# Altium project higgs.PrjPCB (part 2 of 7)

## Sheet fpga-bank4.SchDoc: CS - FPGA - Bank 4
size Letter; CheckedBy: J. Brinton; CompanyName: Signal Laboratories, Inc.; DrawnBy: J. Brinton; Engineer: J. Brinton; Address1: 3479 Edison Way; Address2: Menlo Park CA 94025; Address3: +1 (877) 778-8435; Address4: siglabs.com; Revision: 3; SheetNumber: 9; SheetTotal: 47
Used 8 times, as channels MAIN/ARRAY/FPGA30/FPGA4B, MAIN/ARRAY/FPGA31/FPGA4B, MAIN/ARRAY/FPGA32/FPGA4B, MAIN/ARRAY/FPGA33/FPGA4B, MAIN/ARRAY/FPGA20/FPGA4B, MAIN/ARRAY/FPGA21/FPGA4B, MAIN/ARRAY/FPGA22/FPGA4B, MAIN/ARRAY/FPGA23/FPGA4B. Parts and nets are listed once, with the designators drawn on the sheet.
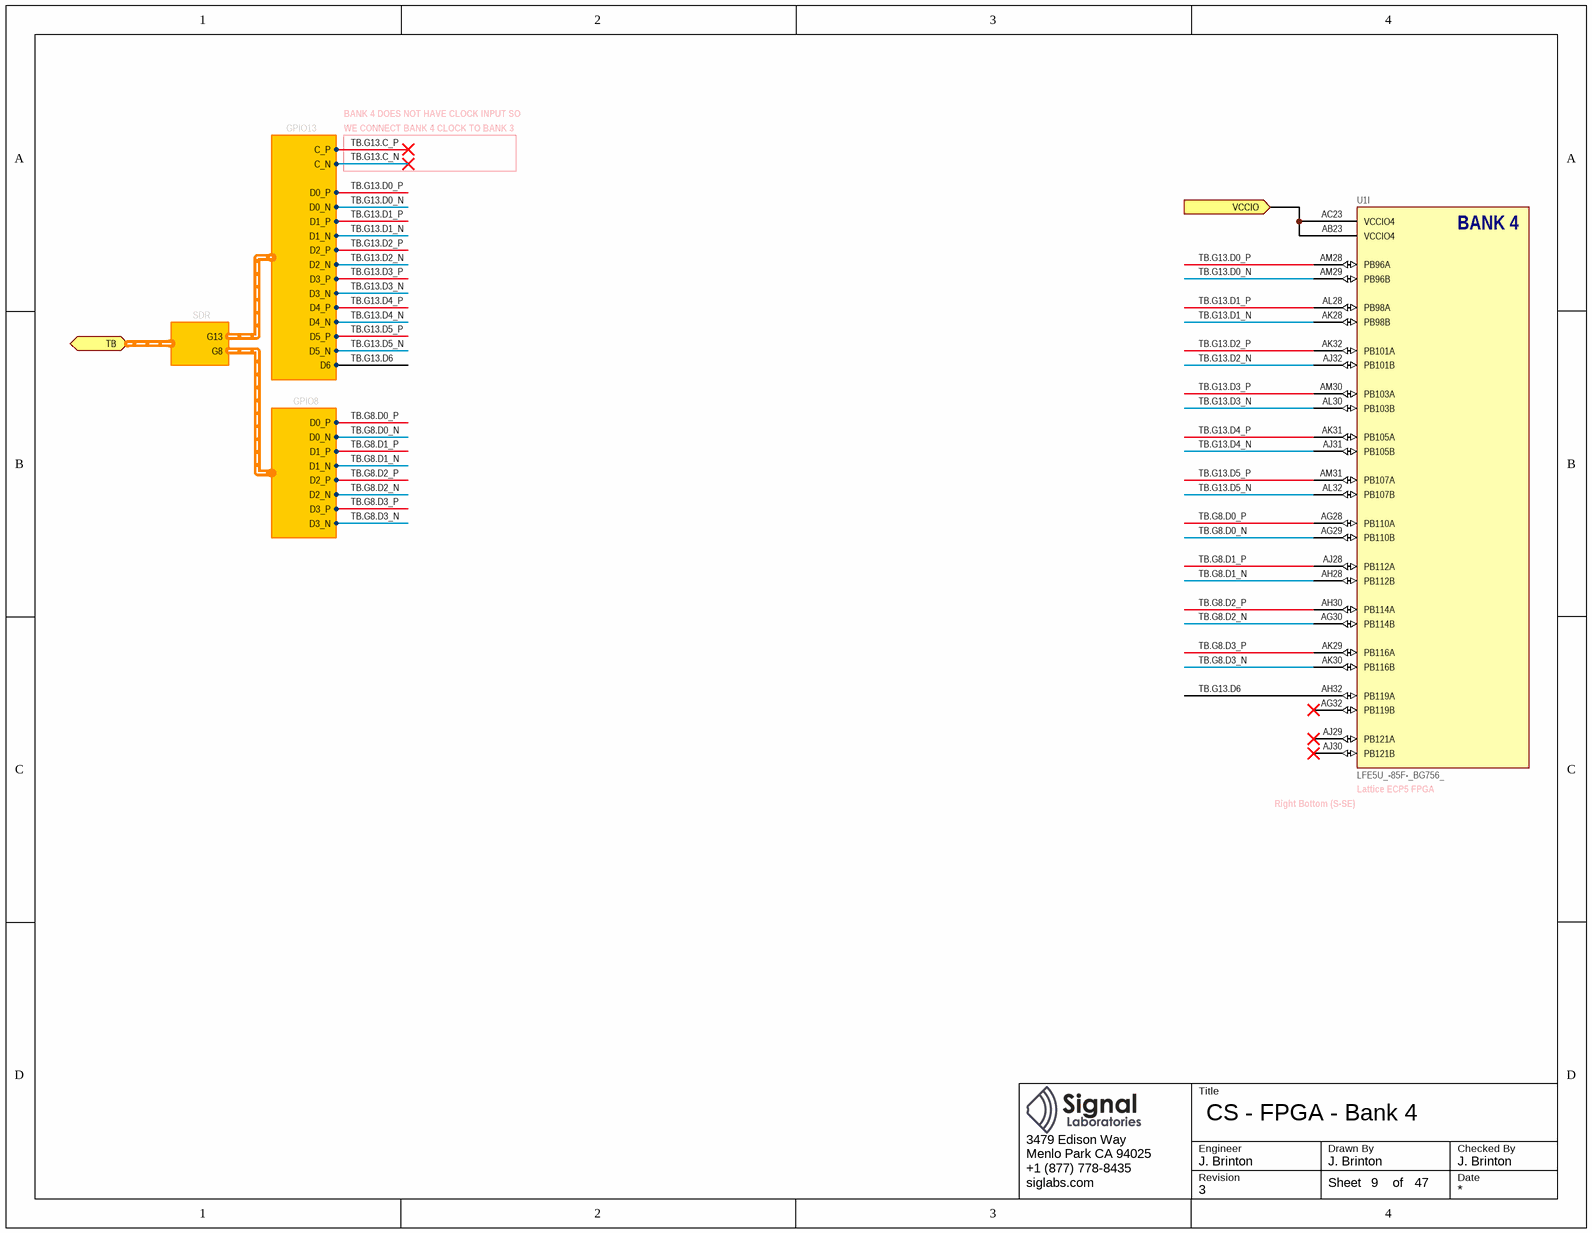
[diagram p8: fpga-bank4.SchDoc]

### Parts
U1  LFE5U_-85F-_BG756_  [caBGA756]  (part I of 19)

### Ports
TB (harness SDR), VCCIO (in)

### Harnesses
SDR: G13, G8
GPIO13: C_P, C_N, D0_P, D0_N, D1_P, D1_N, D2_P, D2_N, D3_P, D3_N, D4_P, D4_N, D5_P, D5_N, D6
GPIO8: D0_P, D0_N, D1_P, D1_N, D2_P, D2_N, D3_P, D3_N

### Nets
TB.G8.D0_N: U1.AG29(PB110B) ; harness GPIO8.D0_N
TB.G8.D0_P: U1.AG28(PB110A) ; harness GPIO8.D0_P
TB.G8.D1_N: U1.AH28(PB112B) ; harness GPIO8.D1_N
TB.G8.D1_P: U1.AJ28(PB112A) ; harness GPIO8.D1_P
TB.G8.D2_N: U1.AG30(PB114B) ; harness GPIO8.D2_N
TB.G8.D2_P: U1.AH30(PB114A) ; harness GPIO8.D2_P
TB.G8.D3_N: U1.AK30(PB116B) ; harness GPIO8.D3_N
TB.G8.D3_P: U1.AK29(PB116A) ; harness GPIO8.D3_P
TB.G13.C_N: harness GPIO13.C_N
TB.G13.C_P: harness GPIO13.C_P
TB.G13.D0_N: U1.AM29(PB96B) ; harness GPIO13.D0_N
TB.G13.D0_P: U1.AM28(PB96A) ; harness GPIO13.D0_P
TB.G13.D1_N: U1.AK28(PB98B) ; harness GPIO13.D1_N
TB.G13.D1_P: U1.AL28(PB98A) ; harness GPIO13.D1_P
TB.G13.D2_N: U1.AJ32(PB101B) ; harness GPIO13.D2_N
TB.G13.D2_P: U1.AK32(PB101A) ; harness GPIO13.D2_P
TB.G13.D3_N: U1.AL30(PB103B) ; harness GPIO13.D3_N
TB.G13.D3_P: U1.AM30(PB103A) ; harness GPIO13.D3_P
TB.G13.D4_N: U1.AJ31(PB105B) ; harness GPIO13.D4_N
TB.G13.D4_P: U1.AK31(PB105A) ; harness GPIO13.D4_P
TB.G13.D5_N: U1.AL32(PB107B) ; harness GPIO13.D5_N
TB.G13.D5_P: U1.AM31(PB107A) ; harness GPIO13.D5_P
TB.G13.D6: U1.AH32(PB119A) ; harness GPIO13.D6
VCCIO: U1.AB23(VCCIO4) U1.AC23(VCCIO4) ; port VCCIO

Not connected (* = marked no-connect by the designer): U1 AG32(PB119B)* AJ29(PB121A)* AJ30(PB121B)*

### Channels
MAIN/ARRAY/FPGA30/FPGA4B: designators end in A#5; ports VCCIO=IL34.VIOTB_FPGA30
MAIN/ARRAY/FPGA31/FPGA4B: designators end in B#5; ports VCCIO=IL34.VIOTB_FPGA31
MAIN/ARRAY/FPGA32/FPGA4B: designators end in C#5; ports VCCIO=IL34.VIOTB_FPGA32
MAIN/ARRAY/FPGA33/FPGA4B: designators end in D#5; ports VCCIO=IL34.VIOTB_FPGA33
MAIN/ARRAY/FPGA20/FPGA4B: designators end in E#5; ports VCCIO=A.VIOTB_FPGA20
MAIN/ARRAY/FPGA21/FPGA4B: designators end in F#5; ports VCCIO=A.VIOTB_FPGA21
MAIN/ARRAY/FPGA22/FPGA4B: designators end in G#5; ports VCCIO=A.VIOTB_FPGA22
MAIN/ARRAY/FPGA23/FPGA4B: designators end in H#5; ports VCCIO=A.VIOTB_FPGA23

### Notes on the sheet
- BANK 4 DOES NOT HAVE CLOCK INPUT SO
- WE CONNECT BANK 4 CLOCK TO BANK 3
- (near U1) Right Bottom (S-SE)
- (near U1) Lattice ECP5 FPGA
- Title
- Engineer
- Revision
- Drawn By
- Checked By
- Date
- Sheet
- of
- (in symbol LFE5U_-85F-_BG756_, part I) BANK 4

### Library data of the parts
U1 = LFE5U_-85F-_BG756_: ECP5 FPGA, 85k LUT, 756-caBGA; Manufacturer: Lattice Semiconductor; Manufacturer P/N: LFE5U_-85F-_BG756_

## Sheet fpga-bank6.SchDoc: CS - FPGA - Bank 6
size Letter; CheckedBy: J. Brinton; CompanyName: Signal Laboratories, Inc.; DrawnBy: J. Brinton; Engineer: J. Brinton; Address1: 3479 Edison Way; Address2: Menlo Park CA 94025; Address3: +1 (877) 778-8435; Address4: siglabs.com; Revision: 3; SheetNumber: 10; SheetTotal: 47
Used 8 times, as channels MAIN/ARRAY/FPGA30/FPGA6B, MAIN/ARRAY/FPGA31/FPGA6B, MAIN/ARRAY/FPGA32/FPGA6B, MAIN/ARRAY/FPGA33/FPGA6B, MAIN/ARRAY/FPGA20/FPGA6B, MAIN/ARRAY/FPGA21/FPGA6B, MAIN/ARRAY/FPGA22/FPGA6B, MAIN/ARRAY/FPGA23/FPGA6B. Parts and nets are listed once, with the designators drawn on the sheet.
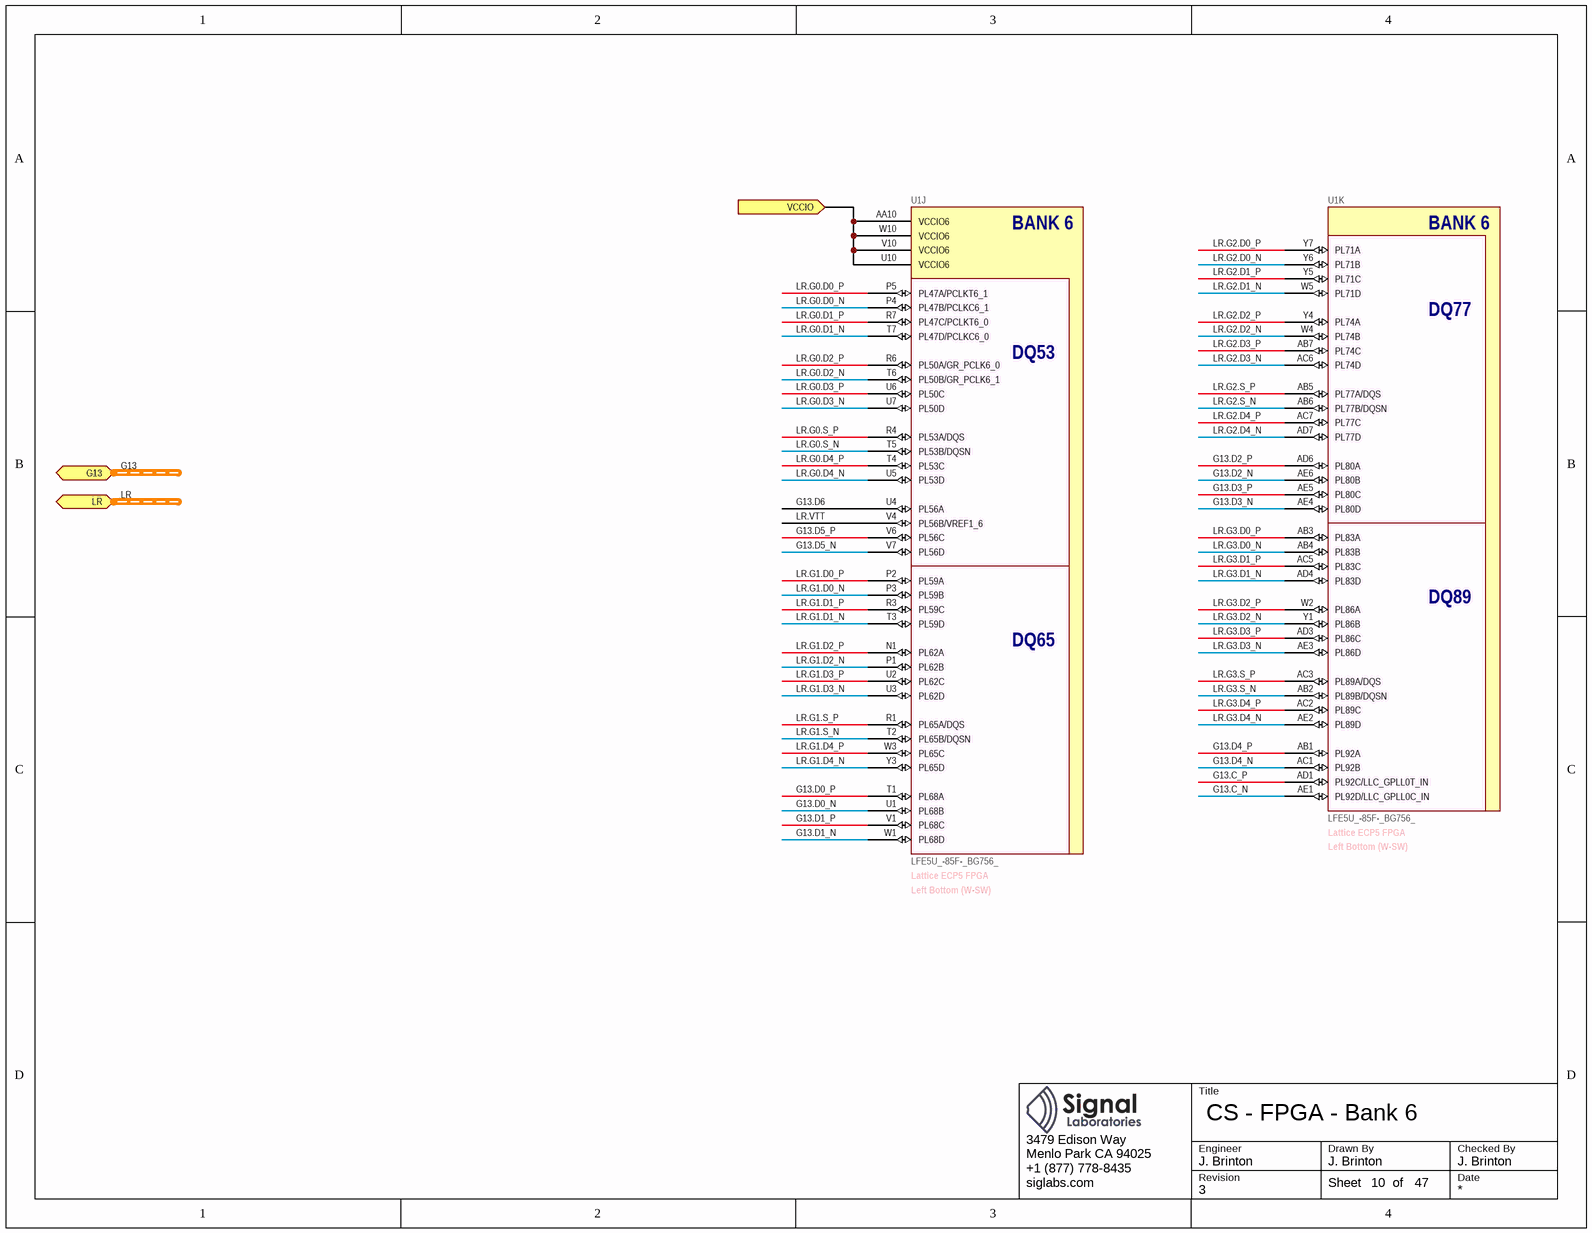
[diagram p9: fpga-bank6.SchDoc]

### Parts
U1  LFE5U_-85F-_BG756_  [caBGA756]  (parts J,K of 19)

### Ports
G13 (harness GPIO13), LR (harness DDR), VCCIO (in)

### Nets
G13.C_N: U1.AE1(PL92D/LLC_GPLL0C_IN)
G13.C_P: U1.AD1(PL92C/LLC_GPLL0T_IN)
G13.D0_N: U1.U1(PL68B)
G13.D0_P: U1.T1(PL68A)
G13.D1_N: U1.W1(PL68D)
G13.D1_P: U1.V1(PL68C)
G13.D2_N: U1.AE6(PL80B)
G13.D2_P: U1.AD6(PL80A)
G13.D3_N: U1.AE4(PL80D)
G13.D3_P: U1.AE5(PL80C)
G13.D4_N: U1.AC1(PL92B)
G13.D4_P: U1.AB1(PL92A)
G13.D5_N: U1.V7(PL56D)
G13.D5_P: U1.V6(PL56C)
G13.D6: U1.U4(PL56A)
LR.G0.D0_N: U1.P4(PL47B/PCLKC6_1)
LR.G0.D0_P: U1.P5(PL47A/PCLKT6_1)
LR.G0.D1_N: U1.T7(PL47D/PCLKC6_0)
LR.G0.D1_P: U1.R7(PL47C/PCLKT6_0)
LR.G0.D2_N: U1.T6(PL50B/GR_PCLK6_1)
LR.G0.D2_P: U1.R6(PL50A/GR_PCLK6_0)
LR.G0.D3_N: U1.U7(PL50D)
LR.G0.D3_P: U1.U6(PL50C)
LR.G0.D4_N: U1.U5(PL53D)
LR.G0.D4_P: U1.T4(PL53C)
LR.G0.S_N: U1.T5(PL53B/DQSN)
LR.G0.S_P: U1.R4(PL53A/DQS)
LR.G1.D0_N: U1.P3(PL59B)
LR.G1.D0_P: U1.P2(PL59A)
LR.G1.D1_N: U1.T3(PL59D)
LR.G1.D1_P: U1.R3(PL59C)
LR.G1.D2_N: U1.P1(PL62B)
LR.G1.D2_P: U1.N1(PL62A)
LR.G1.D3_N: U1.U3(PL62D)
LR.G1.D3_P: U1.U2(PL62C)
LR.G1.D4_N: U1.Y3(PL65D)
LR.G1.D4_P: U1.W3(PL65C)
LR.G1.S_N: U1.T2(PL65B/DQSN)
LR.G1.S_P: U1.R1(PL65A/DQS)
LR.G2.D0_N: U1.Y6(PL71B)
LR.G2.D0_P: U1.Y7(PL71A)
LR.G2.D1_N: U1.W5(PL71D)
LR.G2.D1_P: U1.Y5(PL71C)
LR.G2.D2_N: U1.W4(PL74B)
LR.G2.D2_P: U1.Y4(PL74A)
LR.G2.D3_N: U1.AC6(PL74D)
LR.G2.D3_P: U1.AB7(PL74C)
LR.G2.D4_N: U1.AD7(PL77D)
LR.G2.D4_P: U1.AC7(PL77C)
LR.G2.S_N: U1.AB6(PL77B/DQSN)
LR.G2.S_P: U1.AB5(PL77A/DQS)
LR.G3.D0_N: U1.AB4(PL83B)
LR.G3.D0_P: U1.AB3(PL83A)
LR.G3.D1_N: U1.AD4(PL83D)
LR.G3.D1_P: U1.AC5(PL83C)
LR.G3.D2_N: U1.Y1(PL86B)
LR.G3.D2_P: U1.W2(PL86A)
LR.G3.D3_N: U1.AE3(PL86D)
LR.G3.D3_P: U1.AD3(PL86C)
LR.G3.D4_N: U1.AE2(PL89D)
LR.G3.D4_P: U1.AC2(PL89C)
LR.G3.S_N: U1.AB2(PL89B/DQSN)
LR.G3.S_P: U1.AC3(PL89A/DQS)
LR.VTT: U1.V4(PL56B/VREF1_6)
VCCIO: U1.AA10(VCCIO6) U1.U10(VCCIO6) U1.V10(VCCIO6) U1.W10(VCCIO6) ; port VCCIO

### Channels
MAIN/ARRAY/FPGA30/FPGA6B: designators end in A#6; ports VCCIO=IL68.VIOLR_FPGA30
MAIN/ARRAY/FPGA31/FPGA6B: designators end in B#6; ports VCCIO=B.VIOLR_FPGA31
MAIN/ARRAY/FPGA32/FPGA6B: designators end in C#6; ports VCCIO=B.VIOLR_FPGA32
MAIN/ARRAY/FPGA33/FPGA6B: designators end in D#6; ports VCCIO=B.VIOLR_FPGA33
MAIN/ARRAY/FPGA20/FPGA6B: designators end in E#6; ports VCCIO=IL68.VIOLR_FPGA20
MAIN/ARRAY/FPGA21/FPGA6B: designators end in F#6; ports VCCIO=B.VIOLR_FPGA21
MAIN/ARRAY/FPGA22/FPGA6B: designators end in G#6; ports VCCIO=B.VIOLR_FPGA22
MAIN/ARRAY/FPGA23/FPGA6B: designators end in H#6; ports VCCIO=B.VIOLR_FPGA23

### Buses and harness runs
harness G13 = port G13
harness LR = port LR

### Notes on the sheet
- (near U1) Left Bottom (W-SW)
- (near U1) Lattice ECP5 FPGA
- Title
- Engineer
- Revision
- Drawn By
- Checked By
- Date
- Sheet
- of
- (in symbol LFE5U_-85F-_BG756_, part J) BANK 6; DQ53; DQ65
- (in symbol LFE5U_-85F-_BG756_, part K) BANK 6; DQ77; DQ89

### Library data of the parts
U1 = LFE5U_-85F-_BG756_: as U1 on sheet fpga-bank4; Manufacturer P/N: LFE5U_-85F-_BG756_

## Sheet fpga-bank7.SchDoc: CS - FPGA - Bank 7
size Letter; CheckedBy: J. Brinton; CompanyName: Signal Laboratories, Inc.; DrawnBy: J. Brinton; Engineer: J. Brinton; Address1: 3479 Edison Way; Address2: Menlo Park CA 94025; Address3: +1 (877) 778-8435; Address4: siglabs.com; Revision: 3; SheetNumber: 11; SheetTotal: 47
Used 8 times, as channels MAIN/ARRAY/FPGA30/FPGA7B, MAIN/ARRAY/FPGA31/FPGA7B, MAIN/ARRAY/FPGA32/FPGA7B, MAIN/ARRAY/FPGA33/FPGA7B, MAIN/ARRAY/FPGA20/FPGA7B, MAIN/ARRAY/FPGA21/FPGA7B, MAIN/ARRAY/FPGA22/FPGA7B, MAIN/ARRAY/FPGA23/FPGA7B. Parts and nets are listed once, with the designators drawn on the sheet.
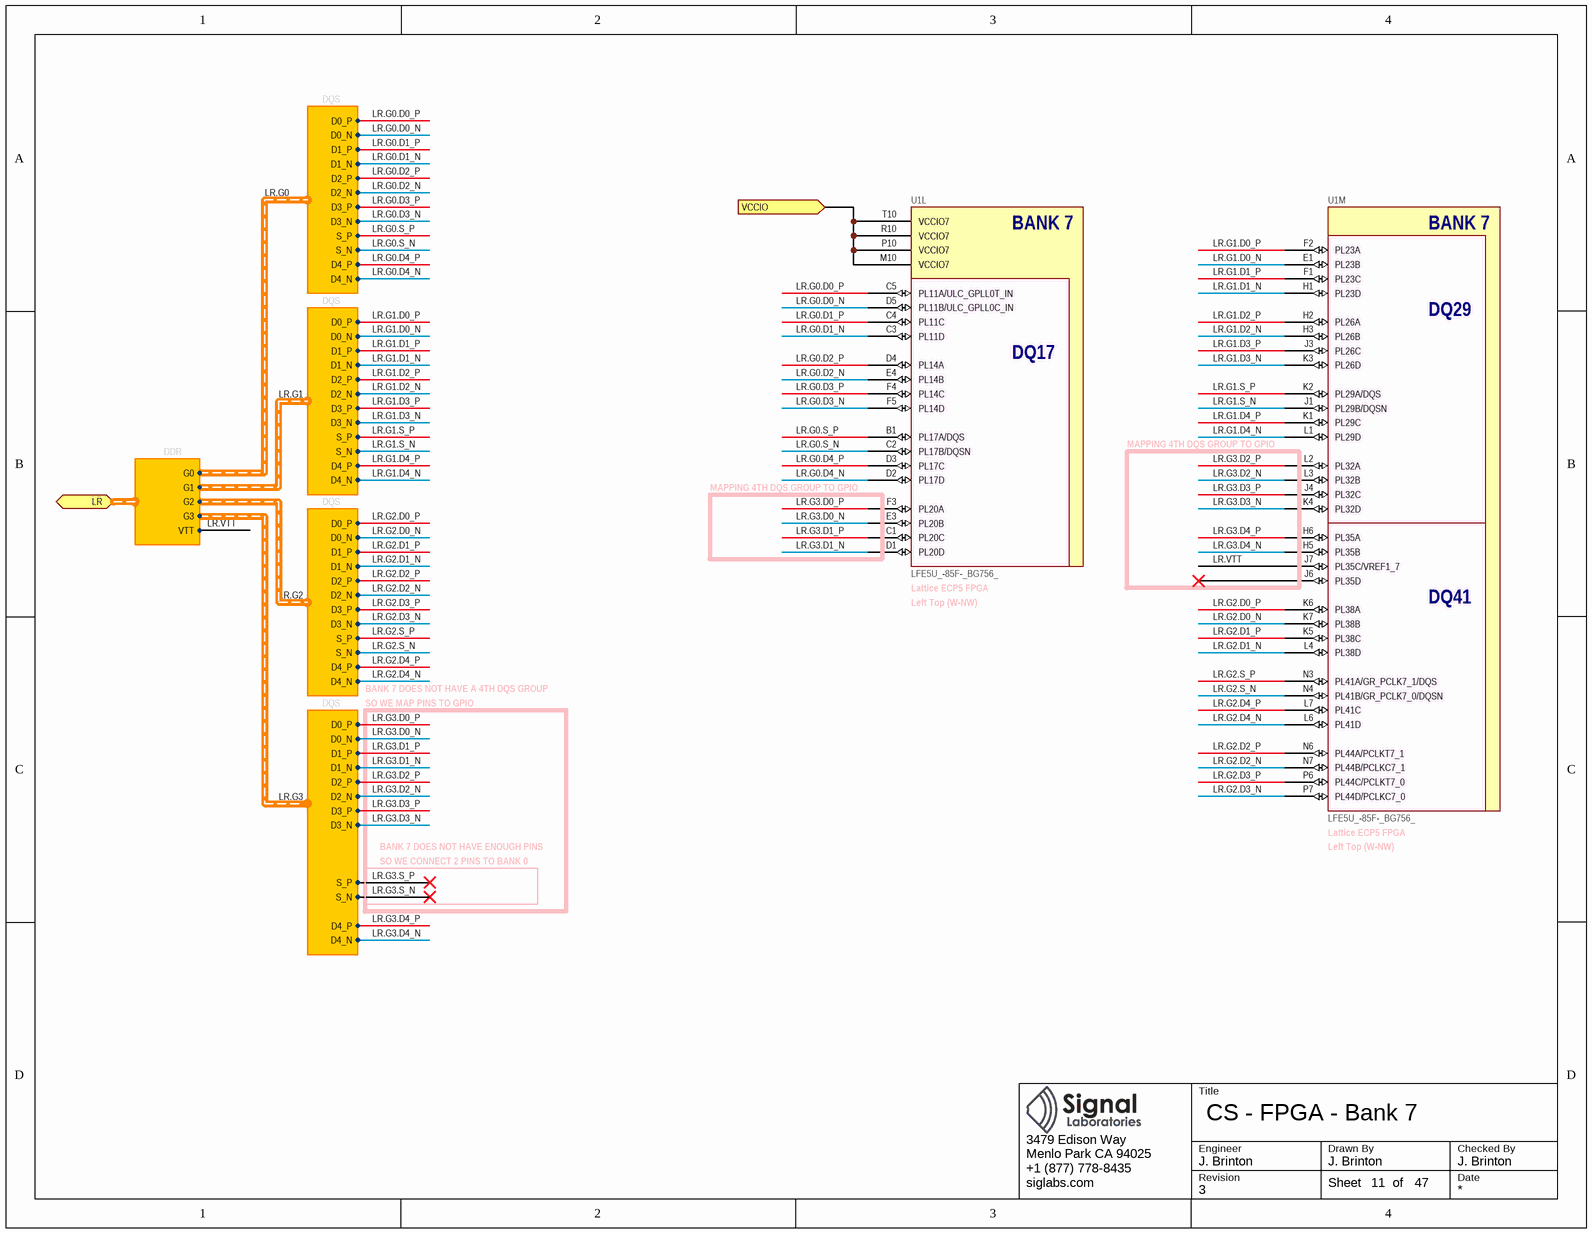
[diagram p10: fpga-bank7.SchDoc]

### Parts
U1  LFE5U_-85F-_BG756_  [caBGA756]  (parts L,M of 19)

### Ports
LR (harness DDR), VCCIO (in)

### Harnesses
DQS: D0_P, D0_N, D1_P, D1_N, D2_P, D2_N, D3_P, D3_N, D4_P, D4_N, S_P, S_N
DDR: G0, G1, G2, G3, VTT

### Nets
LR.G0.D0_N: U1.D5(PL11B/ULC_GPLL0C_IN) ; harness DQS.D0_N
LR.G0.D0_P: U1.C5(PL11A/ULC_GPLL0T_IN) ; harness DQS.D0_P
LR.G0.D1_N: U1.C3(PL11D) ; harness DQS.D1_N
LR.G0.D1_P: U1.C4(PL11C) ; harness DQS.D1_P
LR.G0.D2_N: U1.E4(PL14B) ; harness DQS.D2_N
LR.G0.D2_P: U1.D4(PL14A) ; harness DQS.D2_P
LR.G0.D3_N: U1.F5(PL14D) ; harness DQS.D3_N
LR.G0.D3_P: U1.F4(PL14C) ; harness DQS.D3_P
LR.G0.D4_N: U1.D2(PL17D) ; harness DQS.D4_N
LR.G0.D4_P: U1.D3(PL17C) ; harness DQS.D4_P
LR.G0.S_N: U1.C2(PL17B/DQSN) ; harness DQS.S_N
LR.G0.S_P: U1.B1(PL17A/DQS) ; harness DQS.S_P
LR.G1.D0_N: U1.E1(PL23B) ; harness DQS.D0_N
LR.G1.D0_P: U1.F2(PL23A) ; harness DQS.D0_P
LR.G1.D1_N: U1.H1(PL23D) ; harness DQS.D1_N
LR.G1.D1_P: U1.F1(PL23C) ; harness DQS.D1_P
LR.G1.D2_N: U1.H3(PL26B) ; harness DQS.D2_N
LR.G1.D2_P: U1.H2(PL26A) ; harness DQS.D2_P
LR.G1.D3_N: U1.K3(PL26D) ; harness DQS.D3_N
LR.G1.D3_P: U1.J3(PL26C) ; harness DQS.D3_P
LR.G1.D4_N: U1.L1(PL29D) ; harness DQS.D4_N
LR.G1.D4_P: U1.K1(PL29C) ; harness DQS.D4_P
LR.G1.S_N: U1.J1(PL29B/DQSN) ; harness DQS.S_N
LR.G1.S_P: U1.K2(PL29A/DQS) ; harness DQS.S_P
LR.G2.D0_N: U1.K7(PL38B) ; harness DQS.D0_N
LR.G2.D0_P: U1.K6(PL38A) ; harness DQS.D0_P
LR.G2.D1_N: U1.L4(PL38D) ; harness DQS.D1_N
LR.G2.D1_P: U1.K5(PL38C) ; harness DQS.D1_P
LR.G2.D2_N: U1.N7(PL44B/PCLKC7_1) ; harness DQS.D2_N
LR.G2.D2_P: U1.N6(PL44A/PCLKT7_1) ; harness DQS.D2_P
LR.G2.D3_N: U1.P7(PL44D/PCLKC7_0) ; harness DQS.D3_N
LR.G2.D3_P: U1.P6(PL44C/PCLKT7_0) ; harness DQS.D3_P
LR.G2.D4_N: U1.L6(PL41D) ; harness DQS.D4_N
LR.G2.D4_P: U1.L7(PL41C) ; harness DQS.D4_P
LR.G2.S_N: U1.N4(PL41B/GR_PCLK7_0/DQSN) ; harness DQS.S_N
LR.G2.S_P: U1.N3(PL41A/GR_PCLK7_1/DQS) ; harness DQS.S_P
LR.G3.D0_N: U1.E3(PL20B) ; harness DQS.D0_N
LR.G3.D0_P: U1.F3(PL20A) ; harness DQS.D0_P
LR.G3.D1_N: U1.D1(PL20D) ; harness DQS.D1_N
LR.G3.D1_P: U1.C1(PL20C) ; harness DQS.D1_P
LR.G3.D2_N: U1.L3(PL32B) ; harness DQS.D2_N
LR.G3.D2_P: U1.L2(PL32A) ; harness DQS.D2_P
LR.G3.D3_N: U1.K4(PL32D) ; harness DQS.D3_N
LR.G3.D3_P: U1.J4(PL32C) ; harness DQS.D3_P
LR.G3.D4_N: U1.H5(PL35B) ; harness DQS.D4_N
LR.G3.D4_P: U1.H6(PL35A) ; harness DQS.D4_P
LR.G3.S_N: harness DQS.S_N
LR.G3.S_P: harness DQS.S_P
LR.VTT: U1.J7(PL35C/VREF1_7) ; port LR.VTT
VCCIO: U1.M10(VCCIO7) U1.P10(VCCIO7) U1.R10(VCCIO7) U1.T10(VCCIO7) ; port VCCIO

Not connected (* = marked no-connect by the designer): U1 J6(PL35D)*

### Channels
MAIN/ARRAY/FPGA30/FPGA7B: designators end in A#7; ports VCCIO=B.VIOLR_FPGA30
MAIN/ARRAY/FPGA31/FPGA7B: designators end in B#7; ports VCCIO=B.VIOLR_FPGA31
MAIN/ARRAY/FPGA32/FPGA7B: designators end in C#7; ports VCCIO=B.VIOLR_FPGA32
MAIN/ARRAY/FPGA33/FPGA7B: designators end in D#7; ports VCCIO=B.VIOLR_FPGA33
MAIN/ARRAY/FPGA20/FPGA7B: designators end in E#7; ports VCCIO=IL07.VIOLR_FPGA20
MAIN/ARRAY/FPGA21/FPGA7B: designators end in F#7; ports VCCIO=IL07.VIOLR_FPGA21
MAIN/ARRAY/FPGA22/FPGA7B: designators end in G#7; ports VCCIO=IL07.VIOLR_FPGA22
MAIN/ARRAY/FPGA23/FPGA7B: designators end in H#7; ports VCCIO=IL07.VIOLR_FPGA23

### Notes on the sheet
- (near U1) MAPPING 4TH DQS GROUP TO GPIO
- (near U1) Left Top (W-NW)
- (near U1) Lattice ECP5 FPGA
- BANK 7 DOES NOT HAVE A 4TH DQS GROUP
- SO WE MAP PINS TO GPIO
- BANK 7 DOES NOT HAVE ENOUGH PINS
- SO WE CONNECT 2 PINS TO BANK 0
- Title
- Engineer
- Revision
- Drawn By
- Checked By
- Date
- Sheet
- of
- (in symbol LFE5U_-85F-_BG756_, part L) BANK 7; DQ17
- (in symbol LFE5U_-85F-_BG756_, part M) BANK 7; DQ29; DQ41

### Library data of the parts
U1 = LFE5U_-85F-_BG756_: as U1 on sheet fpga-bank4; Manufacturer P/N: LFE5U_-85F-_BG756_

## Sheet fpga-bank8.SchDoc: CS - FPGA - Bank 8
size Letter; CheckedBy: J. Brinton; CompanyName: Signal Laboratories, Inc.; DrawnBy: J. Brinton; Engineer: J. Brinton; Address1: 3479 Edison Way; Address2: Menlo Park CA 94025; Address3: +1 (877) 778-8435; Address4: siglabs.com; Revision: 3; SheetNumber: 12; SheetTotal: 47
Used 8 times, as channels MAIN/ARRAY/FPGA30/FPGA8B, MAIN/ARRAY/FPGA31/FPGA8B, MAIN/ARRAY/FPGA32/FPGA8B, MAIN/ARRAY/FPGA33/FPGA8B, MAIN/ARRAY/FPGA20/FPGA8B, MAIN/ARRAY/FPGA21/FPGA8B, MAIN/ARRAY/FPGA22/FPGA8B, MAIN/ARRAY/FPGA23/FPGA8B. Parts and nets are listed once, with the designators drawn on the sheet.
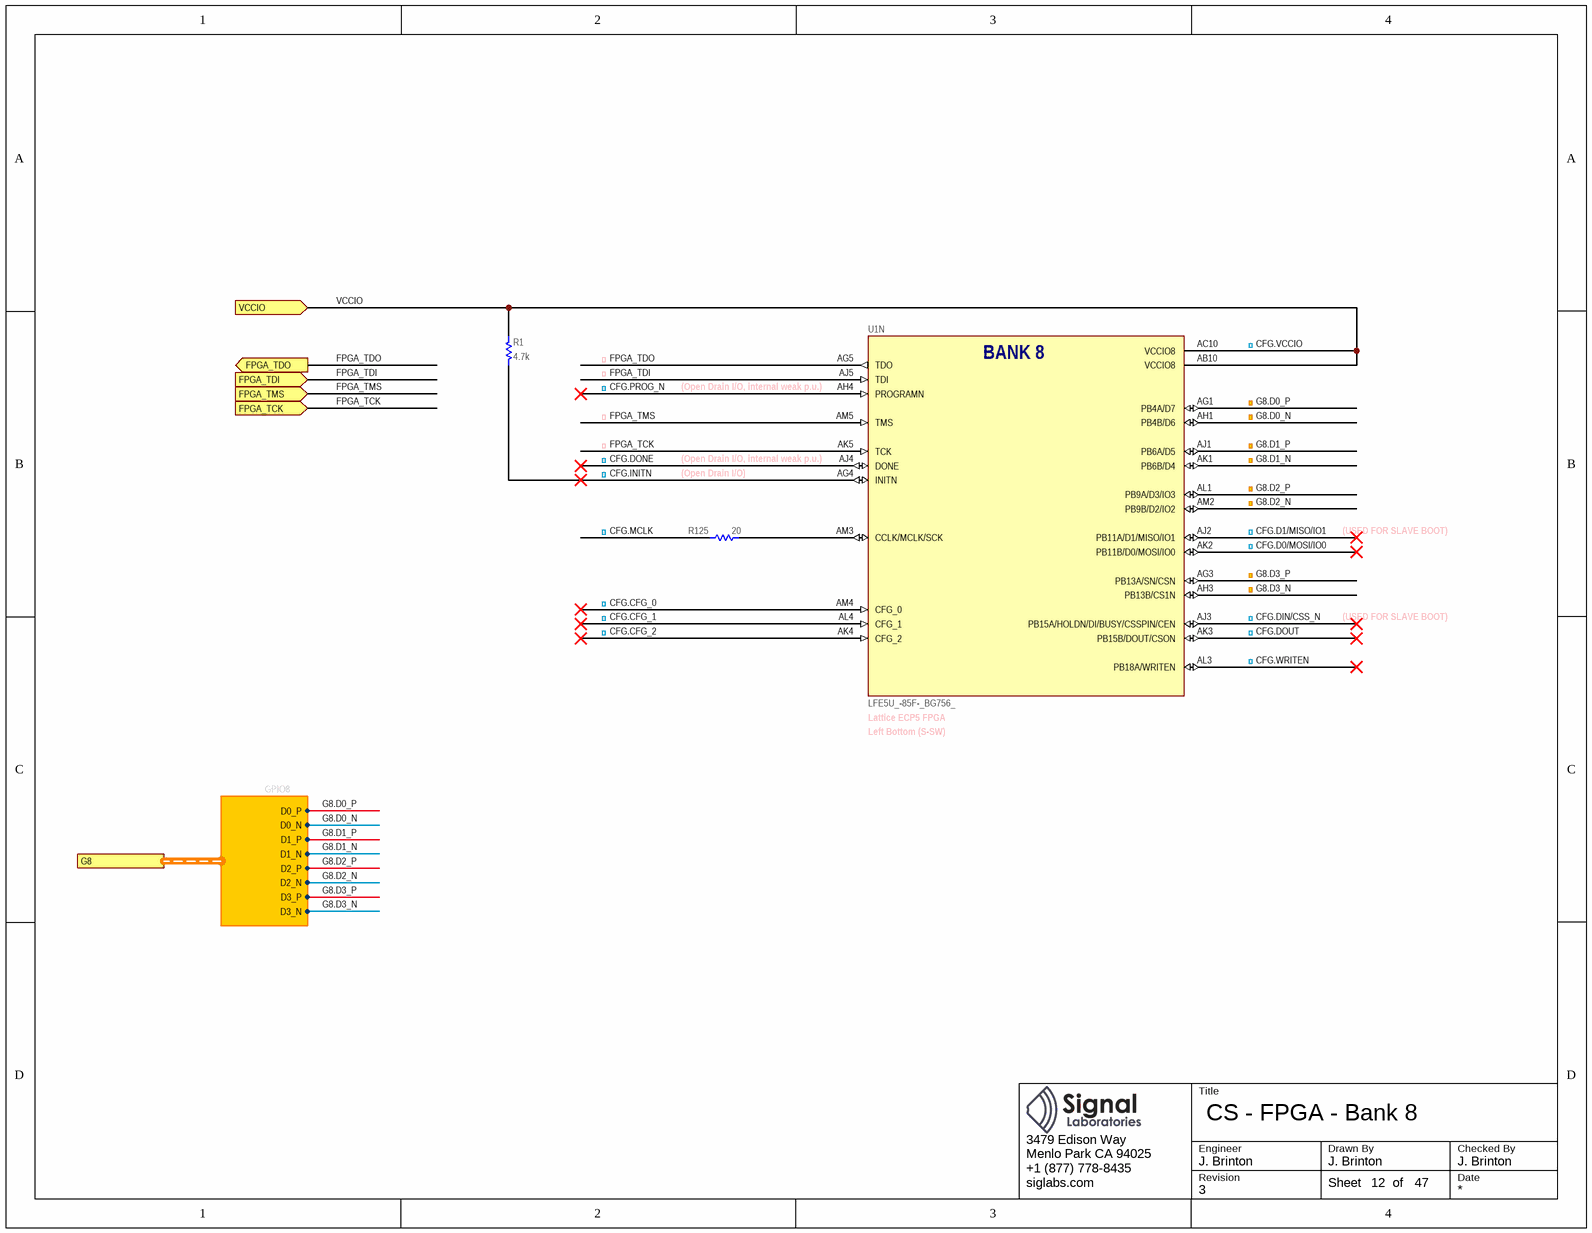
[diagram p11: fpga-bank8.SchDoc]

### Parts
R1  value 4.7k  [RESC1005X40N]  (hidden comment: ERJ-2RKF4701X)
R125  value 20  [RESC1005X40N]  (hidden comment: ERJ-2RKF20R0X)
U1  LFE5U_-85F-_BG756_  [caBGA756]  (part N of 19)

### Ports
FPGA_TCK (in), FPGA_TDI (in), FPGA_TDO (out), FPGA_TMS (in), G8 (harness GPIO8), VCCIO (in)

### Harnesses
GPIO8: D0_P, D0_N, D1_P, D1_N, D2_P, D2_N, D3_P, D3_N

### Nets
CFG.CFG_0: U1.AM4(CFG_0)
CFG.CFG_1: U1.AL4(CFG_1)
CFG.CFG_2: U1.AK4(CFG_2)
CFG.D0/MOSI/IO0: U1.AK2(PB11B/D0/MOSI/IO0)
CFG.D1/MISO/IO1: U1.AJ2(PB11A/D1/MISO/IO1)
CFG.DIN/CSS_N: U1.AJ3(PB15A/HOLDN/DI/BUSY/CSSPIN/CEN)
CFG.DONE: U1.AJ4(DONE)
CFG.DOUT: U1.AK3(PB15B/DOUT/CSON)
CFG.INITN: R1.1 U1.AG4(INITN)
CFG.MCLK: R125.1
CFG.PROG_N: U1.AH4(PROGRAMN)
CFG.VCCIO: R1.2 U1.AB10(VCCIO8) U1.AC10(VCCIO8) ; port VCCIO  [also labelled VCCIO]
CFG.WRITEN: U1.AL3(PB18A/WRITEN)
FPGA_TCK: U1.AK5(TCK) ; port FPGA_TCK
FPGA_TDI: U1.AJ5(TDI) ; port FPGA_TDI
FPGA_TDO: U1.AG5(TDO) ; port FPGA_TDO
FPGA_TMS: U1.AM5(TMS) ; port FPGA_TMS
G8.D0_N: U1.AH1(PB4B/D6) ; port G8.D0_N
G8.D0_P: U1.AG1(PB4A/D7) ; port G8.D0_P
G8.D1_N: U1.AK1(PB6B/D4) ; port G8.D1_N
G8.D1_P: U1.AJ1(PB6A/D5) ; port G8.D1_P
G8.D2_N: U1.AM2(PB9B/D2/IO2) ; port G8.D2_N
G8.D2_P: U1.AL1(PB9A/D3/IO3) ; port G8.D2_P
G8.D3_N: U1.AH3(PB13B/CS1N) ; port G8.D3_N
G8.D3_P: U1.AG3(PB13A/SN/CSN) ; port G8.D3_P
NetR125_2: R125.2 U1.AM3(CCLK/MCLK/SCK)

### Channels
MAIN/ARRAY/FPGA30/FPGA8B: designators R1=R1A R125=R125A U1=U1A#8; ports FPGA_TCK=FPGA_TCK_FPGA30 FPGA_TDI=FPGA_TDI_FPGA30 FPGA_TDO=FPGA_TDO_FPGA30 FPGA_TMS=FPGA_TMS_FPGA30 VCCIO=IL68.VIOTB_FPGA30
MAIN/ARRAY/FPGA31/FPGA8B: designators R1=R1B R125=R125B U1=U1B#8; ports FPGA_TCK=FPGA_TCK_FPGA31 FPGA_TDI=FPGA_TDI_FPGA31 FPGA_TDO=FPGA_TDO_FPGA31 FPGA_TMS=FPGA_TMS_FPGA31 VCCIO=B.VIOTB_FPGA31
MAIN/ARRAY/FPGA32/FPGA8B: designators R1=R1C R125=R125C U1=U1C#8; ports FPGA_TCK=FPGA_TCK_FPGA32 FPGA_TDI=FPGA_TDI_FPGA32 FPGA_TDO=FPGA_TDO_FPGA32 FPGA_TMS=FPGA_TMS_FPGA32 VCCIO=B.VIOTB_FPGA32
MAIN/ARRAY/FPGA33/FPGA8B: designators R1=R1D R125=R125D U1=U1D#8; ports FPGA_TCK=FPGA_TCK_FPGA33 FPGA_TDI=FPGA_TDI_FPGA33 FPGA_TDO=FPGA_TDO_FPGA33 FPGA_TMS=FPGA_TMS_FPGA33 VCCIO=B.VIOTB_FPGA33
MAIN/ARRAY/FPGA20/FPGA8B: designators R1=R1E R125=R125E U1=U1E#8; ports FPGA_TCK=FPGA_TCK_FPGA20 FPGA_TDI=FPGA_TDI_FPGA20 FPGA_TDO=FPGA_TDO_FPGA20 FPGA_TMS=FPGA_TMS_FPGA20 VCCIO=IL68.VIOTB_FPGA20
MAIN/ARRAY/FPGA21/FPGA8B: designators R1=R1F R125=R125F U1=U1F#8; ports FPGA_TCK=FPGA_TCK_FPGA21 FPGA_TDI=FPGA_TDI_FPGA21 FPGA_TDO=FPGA_TDO_FPGA21 FPGA_TMS=FPGA_TMS_FPGA21 VCCIO=B.VIOTB_FPGA21
MAIN/ARRAY/FPGA22/FPGA8B: designators R1=R1G R125=R125G U1=U1G#8; ports FPGA_TCK=FPGA_TCK_FPGA22 FPGA_TDI=FPGA_TDI_FPGA22 FPGA_TDO=FPGA_TDO_FPGA22 FPGA_TMS=FPGA_TMS_FPGA22 VCCIO=B.VIOTB_FPGA22
MAIN/ARRAY/FPGA23/FPGA8B: designators R1=R1H R125=R125H U1=U1H#8; ports FPGA_TCK=FPGA_TCK_FPGA23 FPGA_TDI=FPGA_TDI_FPGA23 FPGA_TDO=FPGA_TDO_FPGA23 FPGA_TMS=FPGA_TMS_FPGA23 VCCIO=B.VIOTB_FPGA23

### Notes on the sheet
- (near U1) (Open Drain I/O, internal weak p.u.)
- (Open Drain I/O)
- (USED FOR SLAVE BOOT)
- Left Bottom (S-SW)
- (near U1) Lattice ECP5 FPGA
- Title
- Engineer
- Revision
- Drawn By
- Checked By
- Date
- Sheet
- of
- (in symbol LFE5U_-85F-_BG756_, part N) BANK 8

### Library data of the parts
R1 = RES: Thick Film Resistor 4.7k ±1% 0.1W 75V 0402; Manufacturer: Panasonic; Tcr: ±100; Tr: -55:155; Voltage: 75; Power: 0.1; Tolerance: ±1%; Manufacturer P/N: ERJ-2RKF4701X; Alternatives: *; Footprint: *; Package: 0402
R125 = RES: Thick Film Resistor 20 ±1% 0.1W 75V 0402; Manufacturer: Panasonic; Tcr: ±100; Tr: -55:155; Voltage: 75; Power: 0.1; Tolerance: ±1%; Manufacturer P/N: ERJ-2RKF20R0X; Alternatives: *; Footprint: *; Package: 0402
U1 = LFE5U_-85F-_BG756_: as U1 on sheet fpga-bank4; Manufacturer P/N: LFE5U_-85F-_BG756_

## Sheet fpga-ground.SchDoc: CS - FPGA - Ground
size Letter; CheckedBy: J. Brinton; CompanyName: Signal Laboratories, Inc.; DrawnBy: J. Brinton; Engineer: J. Brinton; Address1: 3479 Edison Way; Address2: Menlo Park CA 94025; Address3: +1 (877) 778-8435; Address4: siglabs.com; Revision: 3; SheetNumber: 14; SheetTotal: 47
Used 8 times, as channels MAIN/ARRAY/FPGA30/FPGAGND, MAIN/ARRAY/FPGA31/FPGAGND, MAIN/ARRAY/FPGA32/FPGAGND, MAIN/ARRAY/FPGA33/FPGAGND, MAIN/ARRAY/FPGA20/FPGAGND, MAIN/ARRAY/FPGA21/FPGAGND, MAIN/ARRAY/FPGA22/FPGAGND, MAIN/ARRAY/FPGA23/FPGAGND. Parts and nets are listed once, with the designators drawn on the sheet.
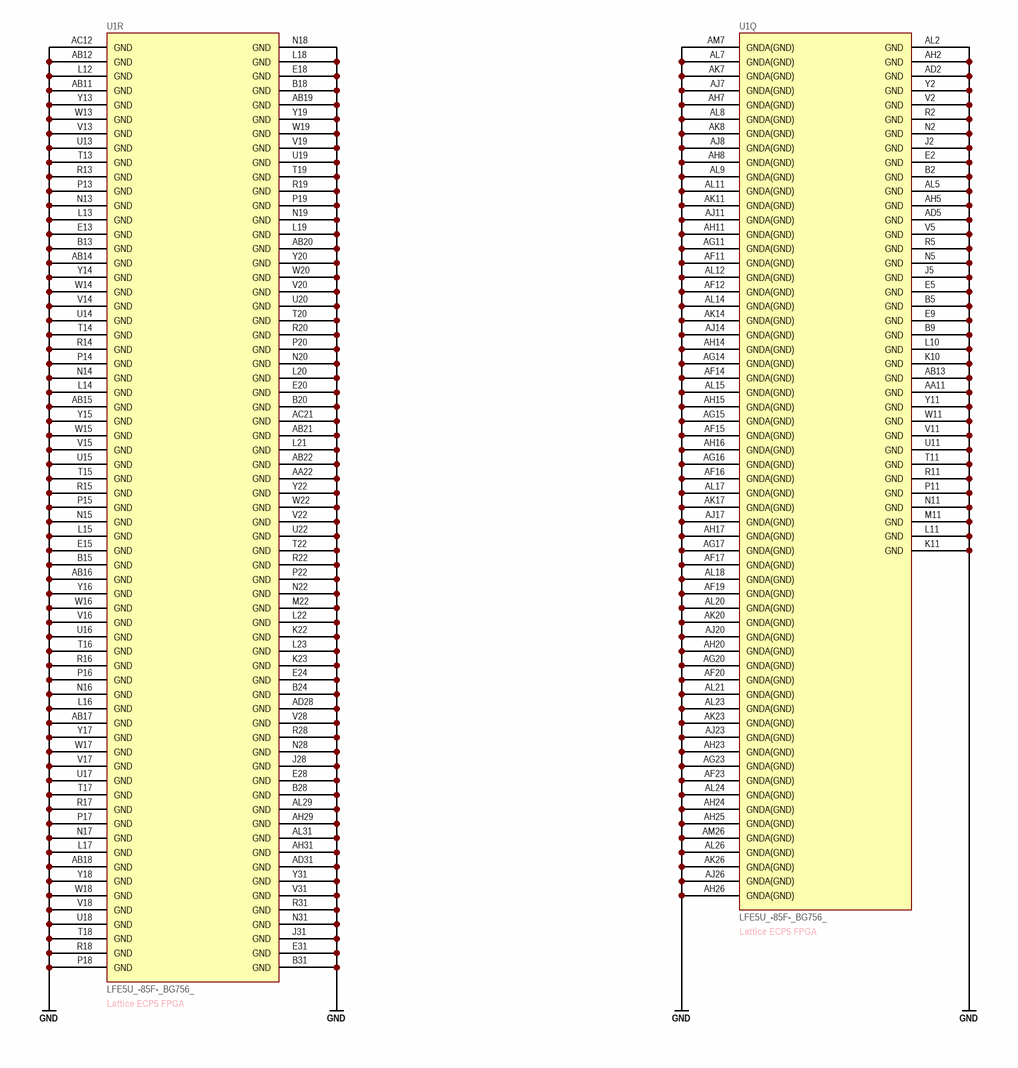
[diagram p12: fpga-ground.SchDoc]

### Parts
U1  LFE5U_-85F-_BG756_  [caBGA756]  (parts Q,R of 19)

### Nets
GND: U1.AA11(GND) U1.AA22(GND) U1.AB11(GND) U1.AB12(GND) U1.AB13(GND) U1.AB14(GND) U1.AB15(GND) U1.AB16(GND) U1.AB17(GND) U1.AB18(GND) U1.AB19(GND) U1.AB20(GND) U1.AB21(GND) U1.AB22(GND) U1.AC12(GND) U1.AC21(GND) U1.AD2(GND) U1.AD5(GND) U1.AD28(GND) U1.AD31(GND) U1.AF11(GNDA(GND)) U1.AF12(GNDA(GND)) U1.AF14(GNDA(GND)) U1.AF15(GNDA(GND)) U1.AF16(GNDA(GND)) U1.AF17(GNDA(GND)) U1.AF19(GNDA(GND)) U1.AF20(GNDA(GND)) U1.AF23(GNDA(GND)) U1.AG11(GNDA(GND)) U1.AG14(GNDA(GND)) U1.AG15(GNDA(GND)) U1.AG16(GNDA(GND)) U1.AG17(GNDA(GND)) U1.AG20(GNDA(GND)) U1.AG23(GNDA(GND)) U1.AH2(GND) U1.AH5(GND) U1.AH7(GNDA(GND)) U1.AH8(GNDA(GND)) U1.AH11(GNDA(GND)) U1.AH14(GNDA(GND)) U1.AH15(GNDA(GND)) U1.AH16(GNDA(GND)) U1.AH17(GNDA(GND)) U1.AH20(GNDA(GND)) U1.AH23(GNDA(GND)) U1.AH24(GNDA(GND)) U1.AH25(GNDA(GND)) U1.AH26(GNDA(GND)) U1.AH29(GND) U1.AH31(GND) U1.AJ7(GNDA(GND)) U1.AJ8(GNDA(GND)) U1.AJ11(GNDA(GND)) U1.AJ14(GNDA(GND)) U1.AJ17(GNDA(GND)) U1.AJ20(GNDA(GND)) U1.AJ23(GNDA(GND)) U1.AJ26(GNDA(GND)) U1.AK7(GNDA(GND)) U1.AK8(GNDA(GND)) U1.AK11(GNDA(GND)) U1.AK14(GNDA(GND)) U1.AK17(GNDA(GND)) U1.AK20(GNDA(GND)) U1.AK23(GNDA(GND)) U1.AK26(GNDA(GND)) U1.AL2(GND) U1.AL5(GND) U1.AL7(GNDA(GND)) U1.AL8(GNDA(GND)) U1.AL9(GNDA(GND)) U1.AL11(GNDA(GND)) U1.AL12(GNDA(GND)) U1.AL14(GNDA(GND)) U1.AL15(GNDA(GND)) U1.AL17(GNDA(GND)) U1.AL18(GNDA(GND)) U1.AL20(GNDA(GND)) U1.AL21(GNDA(GND)) U1.AL23(GNDA(GND)) U1.AL24(GNDA(GND)) U1.AL26(GNDA(GND)) U1.AL29(GND) U1.AL31(GND) U1.AM7(GNDA(GND)) U1.AM26(GNDA(GND)) U1.B2(GND) U1.B5(GND) U1.B9(GND) U1.B13(GND) U1.B15(GND) U1.B18(GND) U1.B20(GND) U1.B24(GND) U1.B28(GND) U1.B31(GND) U1.E2(GND) U1.E5(GND) U1.E9(GND) U1.E13(GND) U1.E15(GND) U1.E18(GND) U1.E20(GND) U1.E24(GND) U1.E28(GND) U1.E31(GND) U1.J2(GND) U1.J5(GND) U1.J28(GND) U1.J31(GND) U1.K10(GND) U1.K11(GND) U1.K22(GND) U1.K23(GND) U1.L10(GND) U1.L11(GND) U1.L12(GND) U1.L13(GND) U1.L14(GND) U1.L15(GND) U1.L16(GND) U1.L17(GND) U1.L18(GND) U1.L19(GND) U1.L20(GND) U1.L21(GND) U1.L22(GND) U1.L23(GND) U1.M11(GND) U1.M22(GND) U1.N2(GND) U1.N5(GND) U1.N11(GND) U1.N13(GND) U1.N14(GND) U1.N15(GND) U1.N16(GND) U1.N17(GND) U1.N18(GND) U1.N19(GND) U1.N20(GND) U1.N22(GND) U1.N28(GND) U1.N31(GND) U1.P11(GND) U1.P13(GND) U1.P14(GND) U1.P15(GND) U1.P16(GND) U1.P17(GND) U1.P18(GND) U1.P19(GND) U1.P20(GND) U1.P22(GND) U1.R2(GND) U1.R5(GND) U1.R11(GND) U1.R13(GND) U1.R14(GND) U1.R15(GND) U1.R16(GND) U1.R17(GND) U1.R18(GND) U1.R19(GND) U1.R20(GND) U1.R22(GND) U1.R28(GND) U1.R31(GND) U1.T11(GND) U1.T13(GND) U1.T14(GND) U1.T15(GND) U1.T16(GND) U1.T17(GND) U1.T18(GND) U1.T19(GND) U1.T20(GND) U1.T22(GND) U1.U11(GND) U1.U13(GND) U1.U14(GND) U1.U15(GND) U1.U16(GND) U1.U17(GND) U1.U18(GND) U1.U19(GND) U1.U20(GND) U1.U22(GND) U1.V2(GND) U1.V5(GND) U1.V11(GND) U1.V13(GND) U1.V14(GND) U1.V15(GND) U1.V16(GND) U1.V17(GND) U1.V18(GND) U1.V19(GND) U1.V20(GND) U1.V22(GND) U1.V28(GND) U1.V31(GND) U1.W11(GND) U1.W13(GND) U1.W14(GND) U1.W15(GND) U1.W16(GND) U1.W17(GND) U1.W18(GND) U1.W19(GND) U1.W20(GND) U1.W22(GND) U1.Y2(GND) U1.Y11(GND) U1.Y13(GND) U1.Y14(GND) U1.Y15(GND) U1.Y16(GND) U1.Y17(GND) U1.Y18(GND) U1.Y19(GND) U1.Y20(GND) U1.Y22(GND) U1.Y31(GND)

### Channels
MAIN/ARRAY/FPGA30/FPGAGND: designators end in A#9
MAIN/ARRAY/FPGA31/FPGAGND: designators end in B#9
MAIN/ARRAY/FPGA32/FPGAGND: designators end in C#9
MAIN/ARRAY/FPGA33/FPGAGND: designators end in D#9
MAIN/ARRAY/FPGA20/FPGAGND: designators end in E#9
MAIN/ARRAY/FPGA21/FPGAGND: designators end in F#9
MAIN/ARRAY/FPGA22/FPGAGND: designators end in G#9
MAIN/ARRAY/FPGA23/FPGAGND: designators end in H#9

### Notes on the sheet
- (near U1) Lattice ECP5 FPGA
- Title
- Engineer
- Revision
- Drawn By
- Checked By
- Date
- Sheet
- of

### Library data of the parts
U1 = LFE5U_-85F-_BG756_: as U1 on sheet fpga-bank4; Manufacturer P/N: LFE5U_-85F-_BG756_

## Sheet fpga-misc.SchDoc: CS - FPGA - Misc
size Letter; CheckedBy: J. Brinton; CompanyName: Signal Laboratories, Inc.; DrawnBy: J. Brinton; Engineer: J. Brinton; Address1: 3479 Edison Way; Address2: Menlo Park CA 94025; Address3: +1 (877) 778-8435; Address4: siglabs.com; Revision: 3; SheetNumber: 15; SheetTotal: 47
Used 8 times, as channels MAIN/ARRAY/FPGA30/FPGAMISC, MAIN/ARRAY/FPGA31/FPGAMISC, MAIN/ARRAY/FPGA32/FPGAMISC, MAIN/ARRAY/FPGA33/FPGAMISC, MAIN/ARRAY/FPGA20/FPGAMISC, MAIN/ARRAY/FPGA21/FPGAMISC, MAIN/ARRAY/FPGA22/FPGAMISC, MAIN/ARRAY/FPGA23/FPGAMISC. Parts and nets are listed once, with the designators drawn on the sheet.
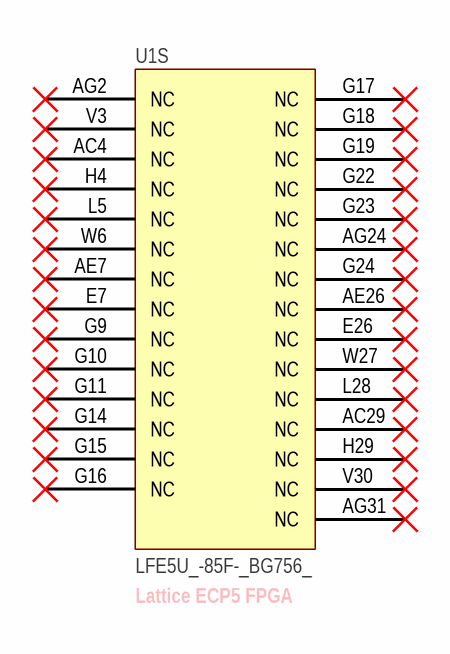
[diagram p13: fpga-misc.SchDoc]

### Parts
U1  LFE5U_-85F-_BG756_  [caBGA756]  (part S of 19)

### Nets

Not connected (* = marked no-connect by the designer): U1 AC4(NC)* AC29(NC)* AE7(NC)* AE26(NC)* AG2(NC)* AG24(NC)* AG31(NC)* E7(NC)* E26(NC)* G9(NC)* G10(NC)* G11(NC)* G14(NC)* G15(NC)* G16(NC)* G17(NC)* G18(NC)* G19(NC)* G22(NC)* G23(NC)* G24(NC)* H4(NC)* H29(NC)* L5(NC)* L28(NC)* V3(NC)* V30(NC)* W6(NC)* W27(NC)*

### Channels
MAIN/ARRAY/FPGA30/FPGAMISC: designators end in A#10
MAIN/ARRAY/FPGA31/FPGAMISC: designators end in B#10
MAIN/ARRAY/FPGA32/FPGAMISC: designators end in C#10
MAIN/ARRAY/FPGA33/FPGAMISC: designators end in D#10
MAIN/ARRAY/FPGA20/FPGAMISC: designators end in E#10
MAIN/ARRAY/FPGA21/FPGAMISC: designators end in F#10
MAIN/ARRAY/FPGA22/FPGAMISC: designators end in G#10
MAIN/ARRAY/FPGA23/FPGAMISC: designators end in H#10

### Notes on the sheet
- (near U1) Lattice ECP5 FPGA
- Title
- Engineer
- Revision
- Drawn By
- Checked By
- Date
- Sheet
- of

### Library data of the parts
U1 = LFE5U_-85F-_BG756_: as U1 on sheet fpga-bank4; Manufacturer P/N: LFE5U_-85F-_BG756_

## Sheet fpga-serdes.SchDoc: CS - FPGA - SERDES
size Letter; CheckedBy: J. Brinton; CompanyName: Signal Laboratories, Inc.; DrawnBy: J. Brinton; Engineer: J. Brinton; Address1: 3479 Edison Way; Address2: Menlo Park CA 94025; Address3: +1 (877) 778-8435; Address4: siglabs.com; Revision: 3; SheetNumber: 16; SheetTotal: 47
Used 8 times, as channels MAIN/ARRAY/FPGA30/FPGASERDES, MAIN/ARRAY/FPGA31/FPGASERDES, MAIN/ARRAY/FPGA32/FPGASERDES, MAIN/ARRAY/FPGA33/FPGASERDES, MAIN/ARRAY/FPGA20/FPGASERDES, MAIN/ARRAY/FPGA21/FPGASERDES, MAIN/ARRAY/FPGA22/FPGASERDES, MAIN/ARRAY/FPGA23/FPGASERDES. Parts and nets are listed once, with the designators drawn on the sheet.
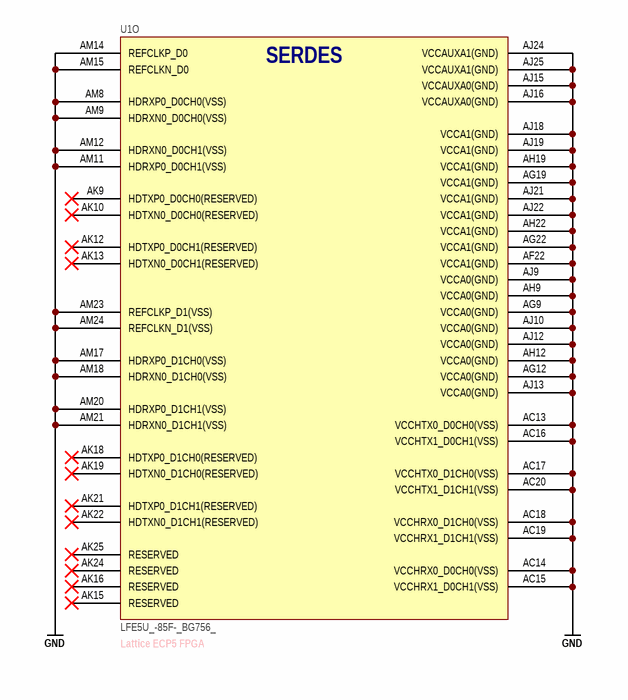
[diagram p14: fpga-serdes.SchDoc]

### Parts
U1  LFE5U_-85F-_BG756_  [caBGA756]  (part O of 19)

### Nets
GND: U1.AC13(VCCHTX0_D0CH0(VSS)) U1.AC14(VCCHRX0_D0CH0(VSS)) U1.AC15(VCCHRX1_D0CH1(VSS)) U1.AC16(VCCHTX1_D0CH1(VSS)) U1.AC17(VCCHTX0_D1CH0(VSS)) U1.AC18(VCCHRX0_D1CH0(VSS)) U1.AC19(VCCHRX1_D1CH1(VSS)) U1.AC20(VCCHTX1_D1CH1(VSS)) U1.AF22(VCCA1(GND)) U1.AG9(VCCA0(GND)) U1.AG12(VCCA0(GND)) U1.AG19(VCCA1(GND)) U1.AG22(VCCA1(GND)) U1.AH9(VCCA0(GND)) U1.AH12(VCCA0(GND)) U1.AH19(VCCA1(GND)) U1.AH22(VCCA1(GND)) U1.AJ9(VCCA0(GND)) U1.AJ10(VCCA0(GND)) U1.AJ12(VCCA0(GND)) U1.AJ13(VCCA0(GND)) U1.AJ15(VCCAUXA0(GND)) U1.AJ16(VCCAUXA0(GND)) U1.AJ18(VCCA1(GND)) U1.AJ19(VCCA1(GND)) U1.AJ21(VCCA1(GND)) U1.AJ22(VCCA1(GND)) U1.AJ24(VCCAUXA1(GND)) U1.AJ25(VCCAUXA1(GND)) U1.AM8(HDRXP0_D0CH0(VSS)) U1.AM9(HDRXN0_D0CH0(VSS)) U1.AM11(HDRXP0_D0CH1(VSS)) U1.AM12(HDRXN0_D0CH1(VSS)) U1.AM14(REFCLKP_D0) U1.AM15(REFCLKN_D0) U1.AM17(HDRXP0_D1CH0(VSS)) U1.AM18(HDRXN0_D1CH0(VSS)) U1.AM20(HDRXP0_D1CH1(VSS)) U1.AM21(HDRXN0_D1CH1(VSS)) U1.AM23(REFCLKP_D1(VSS)) U1.AM24(REFCLKN_D1(VSS))

Not connected (* = marked no-connect by the designer): U1 AK9(HDTXP0_D0CH0(RESERVED))* AK10(HDTXN0_D0CH0(RESERVED))* AK12(HDTXP0_D0CH1(RESERVED))* AK13(HDTXN0_D0CH1(RESERVED))* AK15(RESERVED)* AK16(RESERVED)* AK18(HDTXP0_D1CH0(RESERVED))* AK19(HDTXN0_D1CH0(RESERVED))* AK21(HDTXP0_D1CH1(RESERVED))* AK22(HDTXN0_D1CH1(RESERVED))* AK24(RESERVED)* AK25(RESERVED)*

### Channels
MAIN/ARRAY/FPGA30/FPGASERDES: designators end in A#11
MAIN/ARRAY/FPGA31/FPGASERDES: designators end in B#11
MAIN/ARRAY/FPGA32/FPGASERDES: designators end in C#11
MAIN/ARRAY/FPGA33/FPGASERDES: designators end in D#11
MAIN/ARRAY/FPGA20/FPGASERDES: designators end in E#11
MAIN/ARRAY/FPGA21/FPGASERDES: designators end in F#11
MAIN/ARRAY/FPGA22/FPGASERDES: designators end in G#11
MAIN/ARRAY/FPGA23/FPGASERDES: designators end in H#11

### Notes on the sheet
- (near U1) Lattice ECP5 FPGA
- Title
- Engineer
- Revision
- Drawn By
- Checked By
- Date
- Sheet
- of
- (in symbol LFE5U_-85F-_BG756_, part O) SERDES

### Library data of the parts
U1 = LFE5U_-85F-_BG756_: as U1 on sheet fpga-bank4; Manufacturer P/N: LFE5U_-85F-_BG756_

## Sheet fpga-power.SchDoc: CS - FPGA - Power
size Letter; CheckedBy: J. Brinton; CompanyName: Signal Laboratories, Inc.; DrawnBy: J. Brinton; Engineer: J. Brinton; Address1: 3479 Edison Way; Address2: Menlo Park CA 94025; Address3: +1 (877) 778-8435; Address4: siglabs.com; Revision: 3; SheetNumber: 13; SheetTotal: 47
Used 8 times, as channels MAIN/ARRAY/FPGA30/FPGAPOWER, MAIN/ARRAY/FPGA31/FPGAPOWER, MAIN/ARRAY/FPGA32/FPGAPOWER, MAIN/ARRAY/FPGA33/FPGAPOWER, MAIN/ARRAY/FPGA20/FPGAPOWER, MAIN/ARRAY/FPGA21/FPGAPOWER, MAIN/ARRAY/FPGA22/FPGAPOWER, MAIN/ARRAY/FPGA23/FPGAPOWER. Parts and nets are listed once, with the designators drawn on the sheet.
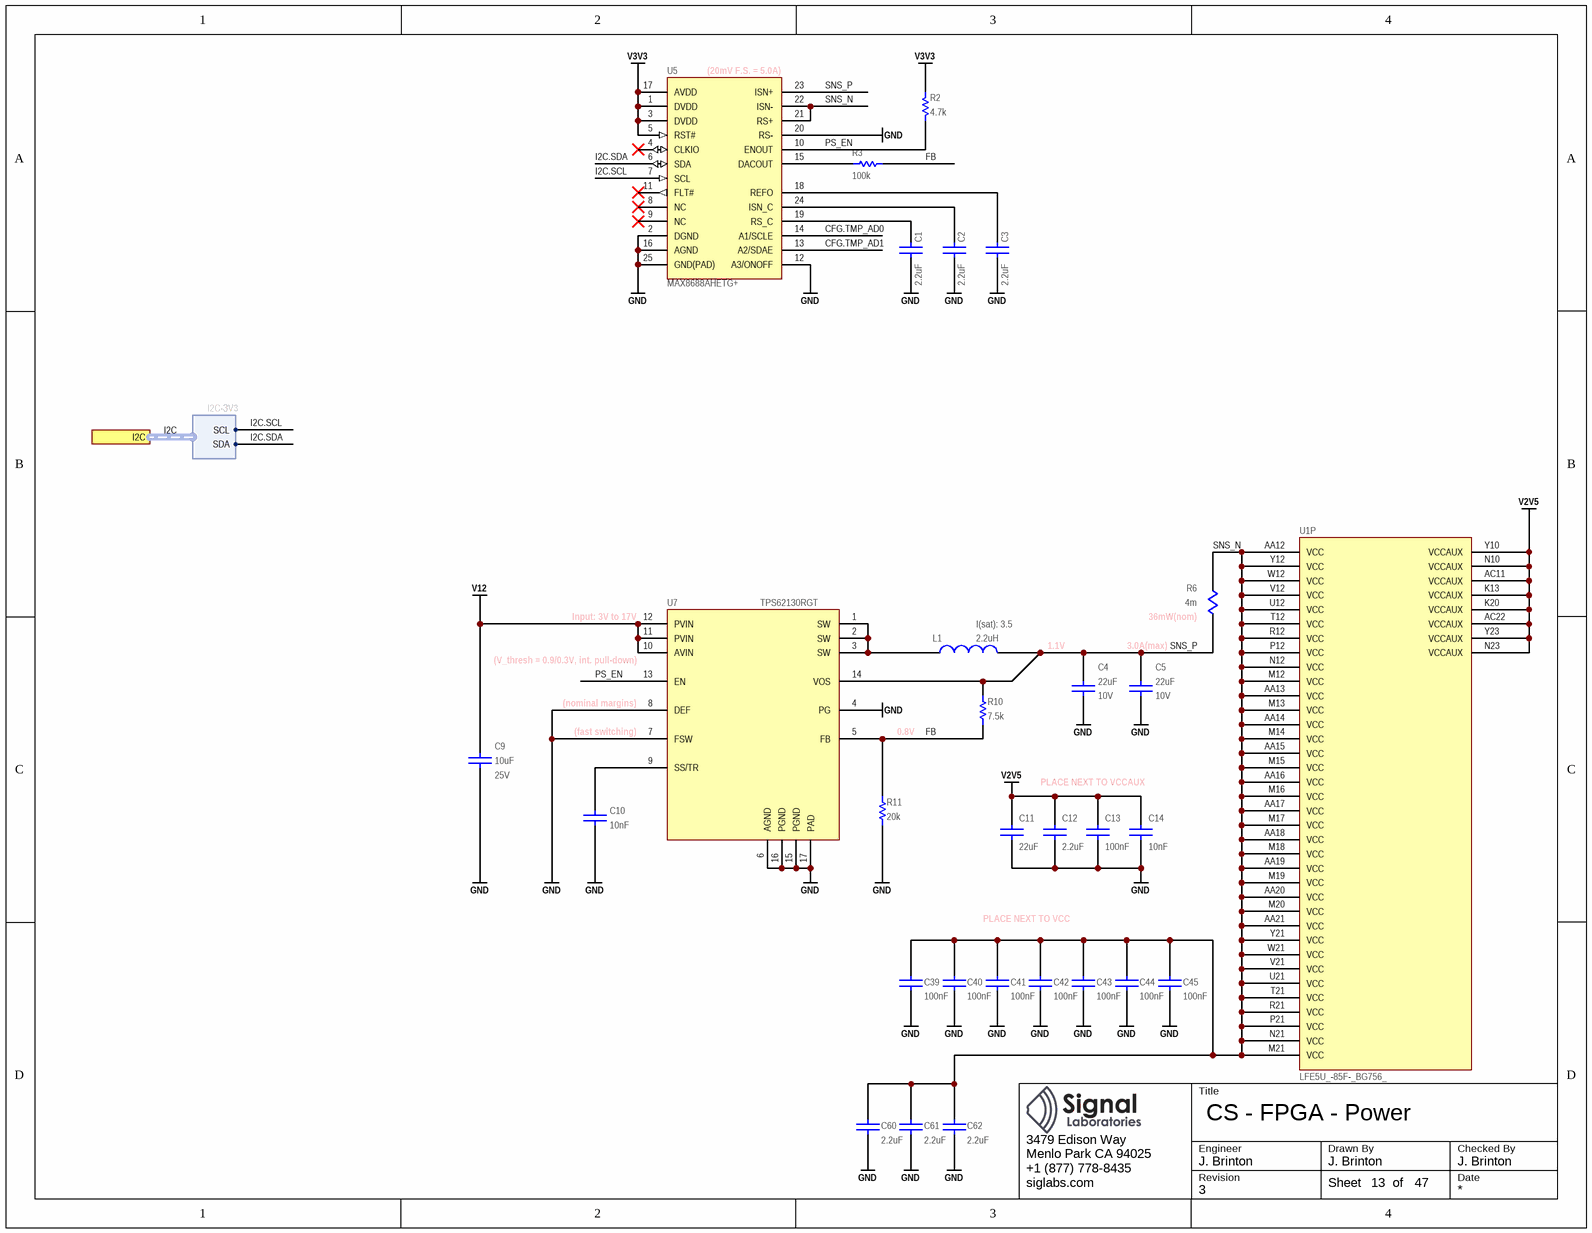
[diagram p15: fpga-power.SchDoc]

### Parts
C1  value 2.2uF  [CAPC160X80X90L20N]  (hidden comment: C1608X7R1A225M080)
C2  value 2.2uF  [CAPC160X80X90L20N]  (hidden comment: C1608X7R1A225M080)
C3  value 2.2uF  [CAPC160X80X90L20N]  (hidden comment: C1608X7R1A225M080)
C4  value 22uF  Voltage: 10V  [CAPC200X125X145L45N]  (hidden comment: C2012X7S1A226M125)
C5  value 22uF  Voltage: 10V  [CAPC200X125X145L45N]  (hidden comment: C2012X7S1A226M125)
C9  value 10uF  Voltage: 25V  [CAPC200X125X145L45N]  (hidden comment: GRM21BC81E106KE51)
C10  value 10nF  [CAPC100X50X55L25N]  (hidden comment: GRM155R71H103KA88)
C11  value 22uF  [CAPC200X125X145L45N]  (hidden comment: C2012X7S1A226M125)
C12  value 2.2uF  [CAPC160X80X90L20N]  (hidden comment: C1608X7R1A225M080)
C13  value 100nF  [CAPC100X50X55L25N]  (hidden comment: GCM155R71H104KE02)
C14  value 10nF  [CAPC100X50X55L25N]  (hidden comment: GRM155R71H103KA88)
C39  value 100nF  [CAPC100X50X55L25N]  (hidden comment: GCM155R71H104KE02)
C40  value 100nF  [CAPC100X50X55L25N]  (hidden comment: GCM155R71H104KE02)
C41  value 100nF  [CAPC100X50X55L25N]  (hidden comment: GCM155R71H104KE02)
C42  value 100nF  [CAPC100X50X55L25N]  (hidden comment: GCM155R71H104KE02)
C43  value 100nF  [CAPC100X50X55L25N]  (hidden comment: GCM155R71H104KE02)
C44  value 100nF  [CAPC100X50X55L25N]  (hidden comment: GCM155R71H104KE02)
C45  value 100nF  [CAPC100X50X55L25N]  (hidden comment: GCM155R71H104KE02)
C60  value 2.2uF  [CAPC160X80X90L20N]  (hidden comment: C1608X7R1A225M080)
C61  value 2.2uF  [CAPC160X80X90L20N]  (hidden comment: C1608X7R1A225M080)
C62  value 2.2uF  [CAPC160X80X90L20N]  (hidden comment: C1608X7R1A225M080)
L1  value 2.2uH  I(sat): 3.5  [XFL4020]  (hidden comment: XFL4020-222ME)
R2  value 4.7k  [RESC1005X40N]  (hidden comment: ERJ-2RKF4701X)
R3  value 100k  [RESC1005X40N]  (hidden comment: ERJ-2RKF1003X)
R6  value 4m  [RESC3216X80L110N]  (hidden comment: CSR1206-0R004F1)
R10  value 7.5k  [RESC2012X70N]  (hidden comment: ERA-6AEB752V)
R11  value 20k  [RESC2012X70N]  (hidden comment: ERA-6AEB203V)
U1  LFE5U_-85F-_BG756_  [caBGA756]  (part P of 19)
U5  MAX8688AHETG+  [QFN25P50_400X400X80L40X24T260N]
U7  TPS62130RGT  [S-PQFP-8N_NOVIA]

### Ports
I2C (harness I2C-3V3)

### Harnesses
I2C-3V3: SCL, SDA

### Nets
GND: C1.1 C2.1 C3.1 C4.1 C5.1 C9.1 C10.2 C11.1 C12.1 C13.1 C14.2 C39.1 C40.1 C41.1 C42.1 C43.1 C44.1 C45.1 C60.1 C61.1 C62.1 R11.1 U5.2(DGND) U5.12(A3/ONOFF) U5.16(AGND) U5.20(RS-) U5.25(GND(PAD)) U7.4(PG) U7.6(AGND) U7.7(FSW) U7.8(DEF) U7.15(PGND) U7.16(PGND) U7.17(PAD)
V2V5: C11.2 C12.2 C13.2 C14.1 U1.AC11(VCCAUX) U1.AC22(VCCAUX) U1.K13(VCCAUX) U1.K20(VCCAUX) U1.N10(VCCAUX) U1.N23(VCCAUX) U1.Y10(VCCAUX) U1.Y23(VCCAUX)
V3V3: R2.2 U5.1(DVDD) U5.3(DVDD) U5.5(RST#) U5.17(AVDD)
V12: C9.2 U7.10(AVIN) U7.11(PVIN) U7.12(PVIN)
CFG.TMP_AD0: U5.14(A1/SCLE)
CFG.TMP_AD1: U5.13(A2/SDAE)
FB: R3.2 R10.1 R11.2 U7.5(FB)
I2C.SCL: U5.7(SCL) ; port I2C.SCL
I2C.SDA: U5.6(SDA) ; port I2C.SDA
PS_EN: R2.1 U5.10(ENOUT) U7.13(EN)
SNS_N: C39.2 C40.2 C41.2 C42.2 C43.2 C44.2 C45.2 C60.2 C61.2 C62.2 R6.2 U1.AA12(VCC) U1.AA13(VCC) U1.AA14(VCC) U1.AA15(VCC) U1.AA16(VCC) U1.AA17(VCC) U1.AA18(VCC) U1.AA19(VCC) U1.AA20(VCC) U1.AA21(VCC) U1.M12(VCC) U1.M13(VCC) U1.M14(VCC) U1.M15(VCC) U1.M16(VCC) U1.M17(VCC) U1.M18(VCC) U1.M19(VCC) U1.M20(VCC) U1.M21(VCC) U1.N12(VCC) U1.N21(VCC) U1.P12(VCC) U1.P21(VCC) U1.R12(VCC) U1.R21(VCC) U1.T12(VCC) U1.T21(VCC) U1.U12(VCC) U1.U21(VCC) U1.V12(VCC) U1.V21(VCC) U1.W12(VCC) U1.W21(VCC) U1.Y12(VCC) U1.Y21(VCC) U5.21(RS+) U5.22(ISN-)
SNS_P: C4.2 C5.2 L1.2 R6.1 R10.2 U5.23(ISN+) U7.14(VOS)
NetC1_2: C1.2 U5.19(RS_C)
NetC2_2: C2.2 U5.24(ISN_C)
NetC3_2: C3.2 U5.18(REFO)
NetC10_1: C10.1 U7.9(SS/TR)
NetL1_1: L1.1 U7.1(SW) U7.2(SW) U7.3(SW)
NetR3_1: R3.1 U5.15(DACOUT)

Not connected (* = marked no-connect by the designer): U5 4(CLKIO)* 8(NC)* 9(NC)* 11(FLT#)*

### Channels
MAIN/ARRAY/FPGA30/FPGAPOWER: designators C1=C1A C2=C2A C3=C3A C4=C4A C5=C5A C9=C9A C10=C10A C11=C11A C12=C12A C13=C13A C14=C14A C39=C39A C40=C40A C41=C41A C42=C42A C43=C43A C44=C44A C45=C45A C60=C60A C61=C61A C62=C62A L1=L1A R2=R2A R3=R3A R6=R6A R10=R10A R11=R11A U1=U1A#12 U5=U5A U7=U7A
MAIN/ARRAY/FPGA31/FPGAPOWER: designators C1=C1B C2=C2B C3=C3B C4=C4B C5=C5B C9=C9B C10=C10B C11=C11B C12=C12B C13=C13B C14=C14B C39=C39B C40=C40B C41=C41B C42=C42B C43=C43B C44=C44B C45=C45B C60=C60B C61=C61B C62=C62B L1=L1B R2=R2B R3=R3B R6=R6B R10=R10B R11=R11B U1=U1B#12 U5=U5B U7=U7B
MAIN/ARRAY/FPGA32/FPGAPOWER: designators C1=C1C C2=C2C C3=C3C C4=C4C C5=C5C C9=C9C C10=C10C C11=C11C C12=C12C C13=C13C C14=C14C C39=C39C C40=C40C C41=C41C C42=C42C C43=C43C C44=C44C C45=C45C C60=C60C C61=C61C C62=C62C L1=L1C R2=R2C R3=R3C R6=R6C R10=R10C R11=R11C U1=U1C#12 U5=U5C U7=U7C
MAIN/ARRAY/FPGA33/FPGAPOWER: designators C1=C1D C2=C2D C3=C3D C4=C4D C5=C5D C9=C9D C10=C10D C11=C11D C12=C12D C13=C13D C14=C14D C39=C39D C40=C40D C41=C41D C42=C42D C43=C43D C44=C44D C45=C45D C60=C60D C61=C61D C62=C62D L1=L1D R2=R2D R3=R3D R6=R6D R10=R10D R11=R11D U1=U1D#12 U5=U5D U7=U7D
MAIN/ARRAY/FPGA20/FPGAPOWER: designators C1=C1E C2=C2E C3=C3E C4=C4E C5=C5E C9=C9E C10=C10E C11=C11E C12=C12E C13=C13E C14=C14E C39=C39E C40=C40E C41=C41E C42=C42E C43=C43E C44=C44E C45=C45E C60=C60E C61=C61E C62=C62E L1=L1E R2=R2E R3=R3E R6=R6E R10=R10E R11=R11E U1=U1E#12 U5=U5E U7=U7E
MAIN/ARRAY/FPGA21/FPGAPOWER: designators C1=C1F C2=C2F C3=C3F C4=C4F C5=C5F C9=C9F C10=C10F C11=C11F C12=C12F C13=C13F C14=C14F C39=C39F C40=C40F C41=C41F C42=C42F C43=C43F C44=C44F C45=C45F C60=C60F C61=C61F C62=C62F L1=L1F R2=R2F R3=R3F R6=R6F R10=R10F R11=R11F U1=U1F#12 U5=U5F U7=U7F
MAIN/ARRAY/FPGA22/FPGAPOWER: designators C1=C1G C2=C2G C3=C3G C4=C4G C5=C5G C9=C9G C10=C10G C11=C11G C12=C12G C13=C13G C14=C14G C39=C39G C40=C40G C41=C41G C42=C42G C43=C43G C44=C44G C45=C45G C60=C60G C61=C61G C62=C62G L1=L1G R2=R2G R3=R3G R6=R6G R10=R10G R11=R11G U1=U1G#12 U5=U5G U7=U7G
MAIN/ARRAY/FPGA23/FPGAPOWER: designators C1=C1H C2=C2H C3=C3H C4=C4H C5=C5H C9=C9H C10=C10H C11=C11H C12=C12H C13=C13H C14=C14H C39=C39H C40=C40H C41=C41H C42=C42H C43=C43H C44=C44H C45=C45H C60=C60H C61=C61H C62=C62H L1=L1H R2=R2H R3=R3H R6=R6H R10=R10H R11=R11H U1=U1H#12 U5=U5H U7=U7H

### Buses and harness runs
harness I2C = port I2C

### Notes on the sheet
- (near U5) (20mV F.S. = 5.0A)
- (near U7) Input: 3V to 17V
- (near U7) (V_thresh = 0.9/0.3V, int. pull-down)
- 1.1V
- (near C5) 3.0A(max)
- (near R6) 36mW(nom)
- (near U7) (fast switching)
- (near U7) (nominal margins)
- 0.8V
- PLACE NEXT TO VCCAUX
- PLACE NEXT TO VCC
- Title
- Engineer
- Revision
- Drawn By
- Checked By
- Date
- Sheet
- of

### Library data of the parts
C1-C3 C12 C60-C62 = CAP: Ceramic Capacitor 2.2uF ±20% 10V X7R 0603; Manufacturer: TDK; Tr: -55:125; Manufacturer P/N: C1608X7R1A225M080; Tolerance: ±20%; Voltage: 10V; Footprint: *; Package: 0603
C4 C5 C11 = CAP: Ceramic Capacitor 22uF ±20% 10V X7S 0805; Manufacturer: TDK; Tr: -55:125; Manufacturer P/N: C2012X7S1A226M125; Tolerance: ±20%; Package: 0805
  C11: Voltage: 10V
C9 = CAP: Ceramic Capacitor 10uF ±10% 25V X6S 0805; Manufacturer: Murata; Tr: -55:105; Manufacturer P/N: GRM21BC81E106KE51; Tolerance: ±10%; Package: 0805
C10 C14 = CAP: Ceramic Capacitor 10nF ±10% 50V X7R 0402; Manufacturer: Murata; Tr: -55:125; Manufacturer P/N: GRM155R71H103KA88; Tolerance: ±10%; Voltage: 50V; Package: 0402
C13 C39-C45 = CAP: Ceramic Capacitor 100nF ±10% 50V X7R 0402; Manufacturer: Murata; Tr: -55:125; Manufacturer P/N: GCM155R71H104KE02; Tolerance: ±10%; Voltage: 50V; Footprint: *; Package: 0402
L1 = COIL: Wirewound Inductor 2.2uH +/-20% 3.5A SMD; Manufacturer: Coilcraft; Manufacturer P/N: XFL4020-222ME
R2 = RES: as R1 on sheet fpga-bank8; Tolerance: ±1%; Manufacturer P/N: ERJ-2RKF4701X; Alternatives: *; Footprint: *; Package: 0402
R3 = RES: Thick Film Resistor 100k ±1% 0.1W 50V 0402; Manufacturer: Panasonic; Tcr: ±100; Tr: -55:155; Voltage: 50; Power: 0.1; Manufacturer P/N: ERJ-2RKF1003X; Tolerance: ±1%; Alternatives: *; Footprint: *; Package: 0402
R6 = CSR1206-0R001F1: Current Sense Resistor 4mOhm +/-1% SMD 1206; Manufacturer: Riedon; Manufacturer P/N: CSR1206-0R004F1; Package: 1206
R10 = RES: Thin Film Resistor 7.5k ±0.1% 0.125W 100V 0805; Manufacturer: Panasonic; Tcr: ±25; Tr: -55:155; Voltage: 100; Power: 0.125; Tolerance: ±0.1%; Manufacturer P/N: ERA-6AEB752V; Alternatives: *; Footprint: *; Package: 0805
R11 = RES: Thin Film Resistor 20k ±0.1% 0.125W 100V 0805; Manufacturer: Panasonic; Tcr: ±25; Tr: -55:155; Voltage: 100; Power: 0.125; Tolerance: ±0.1%; Manufacturer P/N: ERA-6AEB203V; Alternatives: *; Footprint: *; Package: 0805
U1 = LFE5U_-85F-_BG756_: as U1 on sheet fpga-bank4; Manufacturer P/N: LFE5U_-85F-_BG756_
U5 = MAX8688AHETG+: Digital Power-Supply Controller/Monitor; Manufacturer: Maxim Integrated; Manufacturer P/N: MAX8688AHETG+
U7 = TPS62130RGT: 3-17V 3A Step-Down Converter VQFN; Manufacturer: Texas Instruments; Manufacturer P/N: TPS62130RGT

## Sheet tie-il12-il68.SchDoc: CS - Net Tie 12:68
size Letter; CheckedBy: J. Brinton; CompanyName: Signal Laboratories, Inc.; DrawnBy: J. Brinton; Engineer: J. Brinton; Address1: 3479 Edison Way; Address2: Menlo Park CA 94025; Address3: +1 (877) 778-8435; Address4: siglabs.com; Revision: 3; SheetNumber: 26; SheetTotal: 47
Used 6 times, as channels MAIN/ARRAY/TIE-IL12_20-IL68_21, MAIN/ARRAY/TIE-IL12_21-IL68_22, MAIN/ARRAY/TIE-IL12_22-IL68_23, MAIN/ARRAY/TIE-IL12_32-IL68_33, MAIN/ARRAY/TIE-IL12_31-IL68_32, MAIN/ARRAY/TIE-IL12_30-IL68_31. Parts and nets are listed once, with the designators drawn on the sheet.
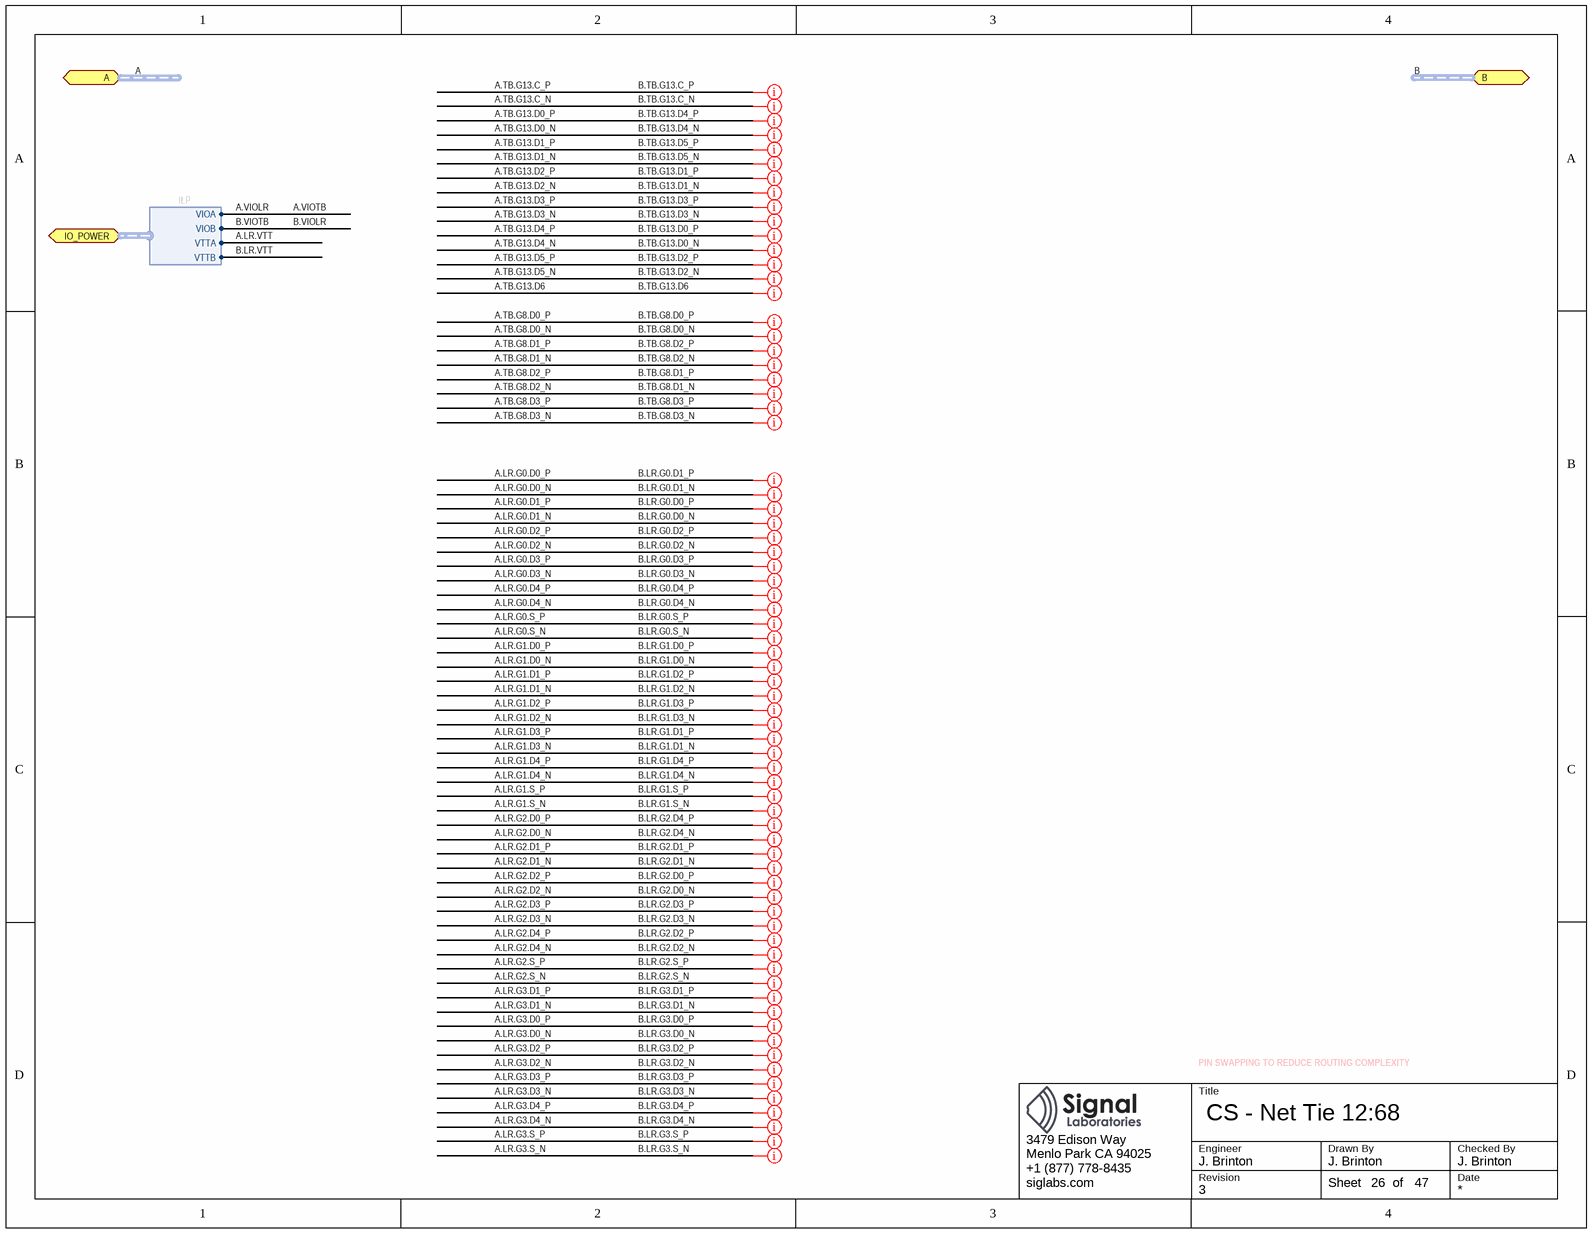
[diagram p16: tie-il12-il68.SchDoc]

### Ports
A (harness IL), B (harness IL), IO_POWER (harness ILP)

### Harnesses
ILP: VIOA, VIOB, VTTA, VTTB

### Channels
MAIN/ARRAY/TIE-IL12_20-IL68_21: no parts or ports
MAIN/ARRAY/TIE-IL12_21-IL68_22: no parts or ports
MAIN/ARRAY/TIE-IL12_22-IL68_23: no parts or ports
MAIN/ARRAY/TIE-IL12_32-IL68_33: no parts or ports
MAIN/ARRAY/TIE-IL12_31-IL68_32: no parts or ports
MAIN/ARRAY/TIE-IL12_30-IL68_31: no parts or ports

### Buses and harness runs
harness A = port A
harness B = port B

### Layout directives
net class z50: A.TB.G13.D6_TIE-IL12_20-IL68_21
net class z50; differential pair; net class loose: A.LR.G0.D0_N_TIE-IL12_20-IL68_21, A.LR.G0.D0_P_TIE-IL12_20-IL68_21, A.LR.G0.D1_N_TIE-IL12_20-IL68_21, A.LR.G0.D1_P_TIE-IL12_20-IL68_21, A.LR.G0.D2_N_TIE-IL12_20-IL68_21, A.LR.G0.D2_P_TIE-IL12_20-IL68_21, A.LR.G0.D3_N_TIE-IL12_20-IL68_21, A.LR.G0.D3_P_TIE-IL12_20-IL68_21, A.LR.G0.D4_N_TIE-IL12_20-IL68_21, A.LR.G0.D4_P_TIE-IL12_20-IL68_21, A.LR.G0.S_N_TIE-IL12_20-IL68_21, A.LR.G0.S_P_TIE-IL12_20-IL68_21, A.LR.G1.D0_N_TIE-IL12_20-IL68_21, A.LR.G1.D0_P_TIE-IL12_20-IL68_21, A.LR.G1.D1_N_TIE-IL12_20-IL68_21, A.LR.G1.D1_P_TIE-IL12_20-IL68_21, A.LR.G1.D2_N_TIE-IL12_20-IL68_21, A.LR.G1.D2_P_TIE-IL12_20-IL68_21, A.LR.G1.D3_N_TIE-IL12_20-IL68_21, A.LR.G1.D3_P_TIE-IL12_20-IL68_21, A.LR.G1.D4_N_TIE-IL12_20-IL68_21, A.LR.G1.D4_P_TIE-IL12_20-IL68_21, A.LR.G1.S_N_TIE-IL12_20-IL68_21, A.LR.G1.S_P_TIE-IL12_20-IL68_21, A.LR.G2.D0_N_TIE-IL12_20-IL68_21, A.LR.G2.D0_P_TIE-IL12_20-IL68_21, A.LR.G2.D1_N_TIE-IL12_20-IL68_21, A.LR.G2.D1_P_TIE-IL12_20-IL68_21, A.LR.G2.D2_N_TIE-IL12_20-IL68_21, A.LR.G2.D2_P_TIE-IL12_20-IL68_21, A.LR.G2.D3_N_TIE-IL12_20-IL68_21, A.LR.G2.D3_P_TIE-IL12_20-IL68_21, A.LR.G2.D4_N_TIE-IL12_20-IL68_21, A.LR.G2.D4_P_TIE-IL12_20-IL68_21, A.LR.G2.S_N_TIE-IL12_20-IL68_21, A.LR.G2.S_P_TIE-IL12_20-IL68_21, A.LR.G3.D0_N_TIE-IL12_20-IL68_21, A.LR.G3.D0_P_TIE-IL12_20-IL68_21, A.LR.G3.D1_N_TIE-IL12_20-IL68_21, A.LR.G3.D1_P_TIE-IL12_20-IL68_21, A.LR.G3.D2_N_TIE-IL12_20-IL68_21, A.LR.G3.D2_P_TIE-IL12_20-IL68_21, A.LR.G3.D3_N_TIE-IL12_20-IL68_21, A.LR.G3.D3_P_TIE-IL12_20-IL68_21, A.LR.G3.D4_N_TIE-IL12_20-IL68_21, A.LR.G3.D4_P_TIE-IL12_20-IL68_21, A.LR.G3.S_N_TIE-IL12_20-IL68_21, A.LR.G3.S_P_TIE-IL12_20-IL68_21, A.TB.G8.D0_N_TIE-IL12_20-IL68_21, A.TB.G8.D0_P_TIE-IL12_20-IL68_21, A.TB.G8.D1_N_TIE-IL12_20-IL68_21, A.TB.G8.D1_P_TIE-IL12_20-IL68_21, A.TB.G8.D2_N_TIE-IL12_20-IL68_21, A.TB.G8.D2_P_TIE-IL12_20-IL68_21, A.TB.G8.D3_N_TIE-IL12_20-IL68_21, A.TB.G8.D3_P_TIE-IL12_20-IL68_21, A.TB.G13.C_N_TIE-IL12_20-IL68_21, A.TB.G13.C_P_TIE-IL12_20-IL68_21, A.TB.G13.D0_N_TIE-IL12_20-IL68_21, A.TB.G13.D0_P_TIE-IL12_20-IL68_21, A.TB.G13.D1_N_TIE-IL12_20-IL68_21, A.TB.G13.D1_P_TIE-IL12_20-IL68_21, A.TB.G13.D2_N_TIE-IL12_20-IL68_21, A.TB.G13.D2_P_TIE-IL12_20-IL68_21, A.TB.G13.D3_N_TIE-IL12_20-IL68_21, A.TB.G13.D3_P_TIE-IL12_20-IL68_21, A.TB.G13.D4_N_TIE-IL12_20-IL68_21, A.TB.G13.D4_P_TIE-IL12_20-IL68_21, A.TB.G13.D5_N_TIE-IL12_20-IL68_21, A.TB.G13.D5_P_TIE-IL12_20-IL68_21

### Notes on the sheet
- PIN SWAPPING TO REDUCE ROUTING COMPLEXITY
- Title
- Engineer
- Revision
- Drawn By
- Checked By
- Date
- Sheet
- of

## Sheet tie-il34-sdram.SchDoc: CS - Net Tie SDRAM
size Letter; CheckedBy: J. Brinton; CompanyName: Signal Laboratories, Inc.; DrawnBy: J. Brinton; Engineer: J. Brinton; Address1: 3479 Edison Way; Address2: Menlo Park CA 94025; Address3: +1 (877) 778-8435; Address4: siglabs.com; Revision: 3; SheetNumber: 19; SheetTotal: 47
Used 4 times, as channels MAIN/ARRAY/SDRAM33, MAIN/ARRAY/SDRAM32, MAIN/ARRAY/SDRAM31, MAIN/ARRAY/SDRAM30. Parts and nets are listed once, with the designators drawn on the sheet.
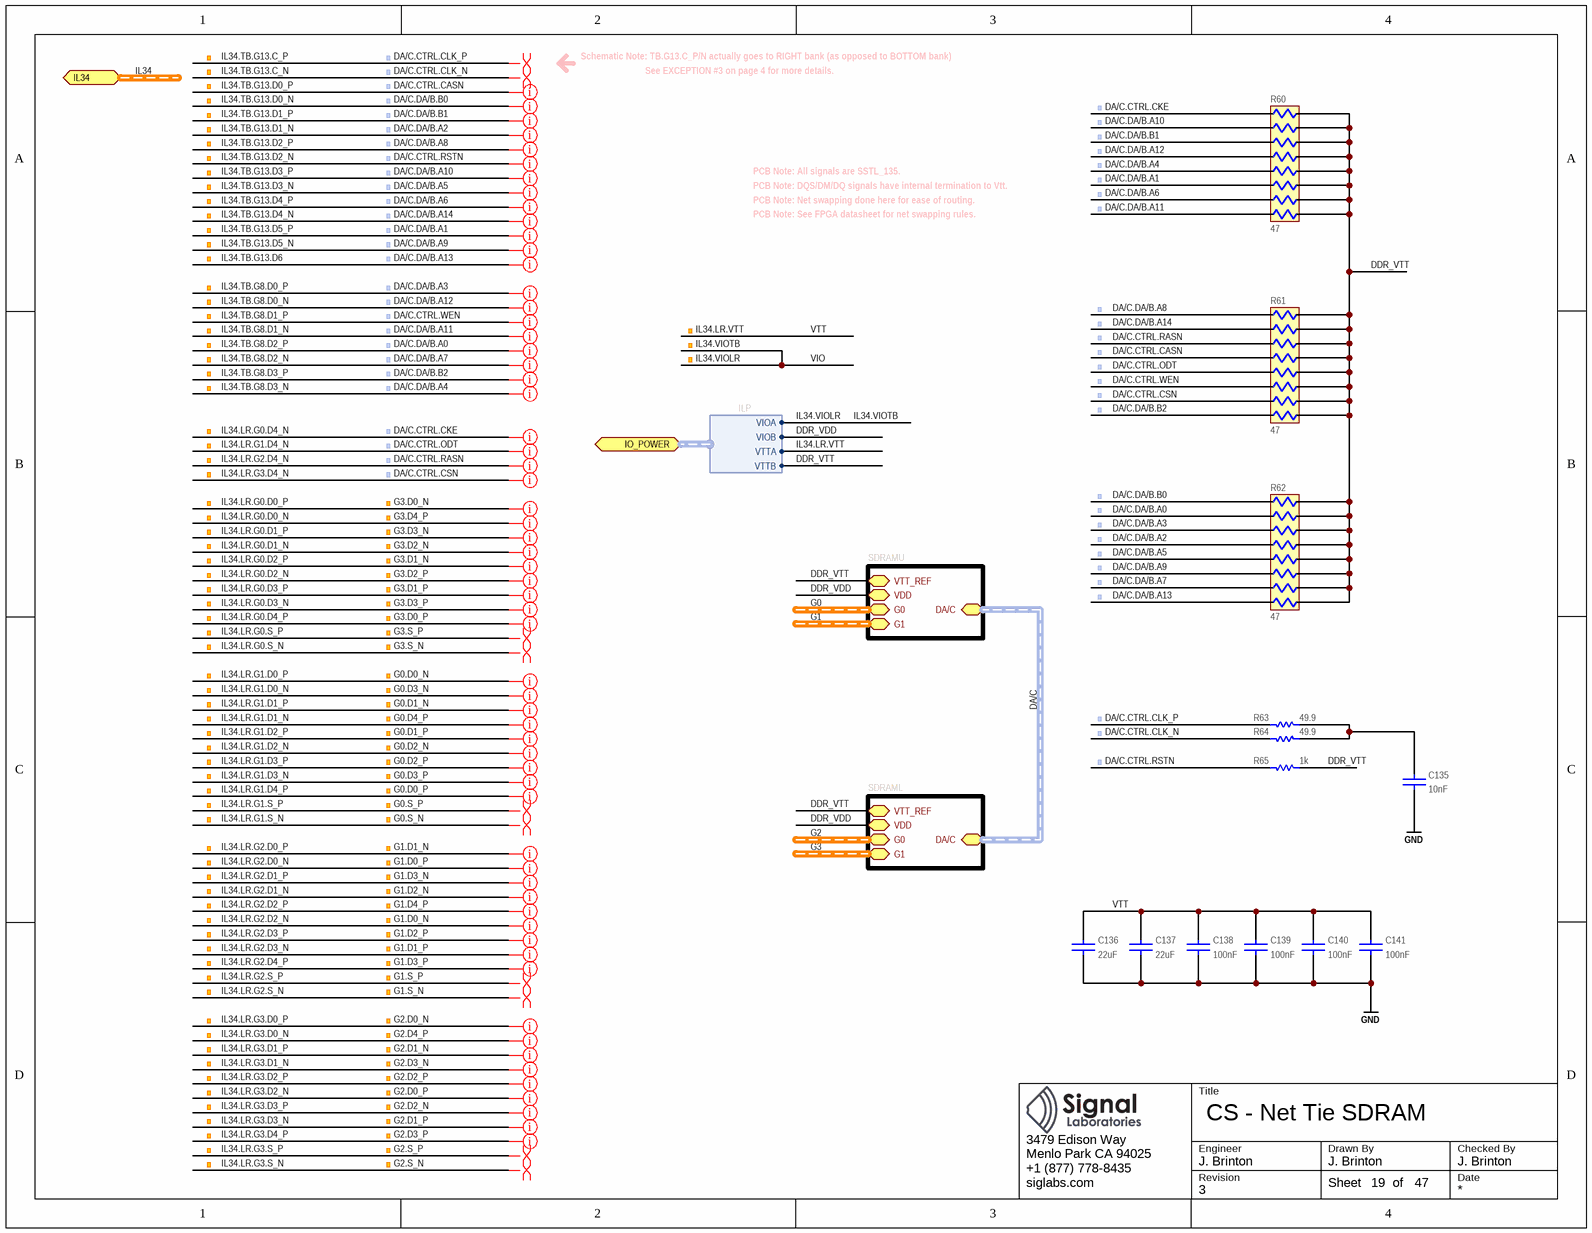
[diagram p17: tie-il34-sdram.SchDoc]

### Parts
C135  value 10nF  [CAPC100X50X55L25N]  (hidden comment: GRM155R71H103KA88)
C136  value 22uF  [CAPC200X125X145L45N]  (hidden comment: C2012X7S1A226M125)
C137  value 22uF  [CAPC200X125X145L45N]  (hidden comment: C2012X7S1A226M125)
C138  value 100nF  [CAPC100X50X55L25N]  (hidden comment: GCM155R71H104KE02)
C139  value 100nF  [CAPC100X50X55L25N]  (hidden comment: GCM155R71H104KE02)
C140  value 100nF  [CAPC100X50X55L25N]  (hidden comment: GCM155R71H104KE02)
C141  value 100nF  [CAPC100X50X55L25N]  (hidden comment: GCM155R71H104KE02)
R60  value 47  [RESCAXE16P50_380X160X55L30X35N]  (hidden comment: EXB-2HV470JV)
R61  value 47  [RESCAXE16P50_380X160X55L30X35N]  (hidden comment: EXB-2HV470JV)
R62  value 47  [RESCAXE16P50_380X160X55L30X35N]  (hidden comment: EXB-2HV470JV)
R63  value 49.9  [RESC1005X40N]  (hidden comment: ERJ-2RKF49R9X)
R64  value 49.9  [RESC1005X40N]  (hidden comment: ERJ-2RKF49R9X)
R65  value 1k  [RESC1005X40N]  (hidden comment: ERJ-2RKF1001X)

### Sub-sheets
SDRAML = sdram.SchDoc: G0 (harness DQS), DA/C (harness DA/C-1V35), G1 (harness DQS), VTT_REF, VDD
SDRAMU = sdram.SchDoc: G0 (harness DQS), DA/C (harness DA/C-1V35), G1 (harness DQS), VTT_REF, VDD

### Ports
IL34 (harness IL), IO_POWER (harness ILP)

### Harnesses
ILP: VIOA, VIOB, VTTA, VTTB

### Nets
GND: C135.1 C136.2 C137.2 C138.1 C139.1 C140.1 C141.1
DA/C.CTRL.CASN: R61.4  [also labelled IL34.TB.G13.D0_P]
DA/C.CTRL.CKE: R60.1  [also labelled IL34.LR.G0.D4_N]
DA/C.CTRL.CLK_N: R64.2  [also labelled IL34.TB.G13.C_N]
DA/C.CTRL.CLK_P: R63.2  [also labelled IL34.TB.G13.C_P]
DA/C.CTRL.CSN: R61.7  [also labelled IL34.LR.G3.D4_N]
DA/C.CTRL.ODT: R61.5  [also labelled IL34.LR.G1.D4_N]
DA/C.CTRL.RASN: R61.3  [also labelled IL34.LR.G2.D4_N]
DA/C.CTRL.RSTN: R65.1  [also labelled IL34.TB.G13.D2_N]
DA/C.CTRL.WEN: R61.6  [also labelled IL34.TB.G8.D1_P]
DA/C.DA/B.A0: R62.2  [also labelled IL34.TB.G8.D2_P]
DA/C.DA/B.A1: R60.6  [also labelled IL34.TB.G13.D5_P]
DA/C.DA/B.A2: R62.4  [also labelled IL34.TB.G13.D1_N]
DA/C.DA/B.A3: R62.3  [also labelled IL34.TB.G8.D0_P]
DA/C.DA/B.A4: R60.5  [also labelled IL34.TB.G8.D3_N]
DA/C.DA/B.A5: R62.5  [also labelled IL34.TB.G13.D3_N]
DA/C.DA/B.A6: R60.7  [also labelled IL34.TB.G13.D4_P]
DA/C.DA/B.A7: R62.7  [also labelled IL34.TB.G8.D2_N]
DA/C.DA/B.A8: R61.1  [also labelled IL34.TB.G13.D2_P]
DA/C.DA/B.A9: R62.6  [also labelled IL34.TB.G13.D5_N]
DA/C.DA/B.A10: R60.2  [also labelled IL34.TB.G13.D3_P]
DA/C.DA/B.A11: R60.8  [also labelled IL34.TB.G8.D1_N]
DA/C.DA/B.A12: R60.4  [also labelled IL34.TB.G8.D0_N]
DA/C.DA/B.A13: R62.8  [also labelled IL34.TB.G13.D6]
DA/C.DA/B.A14: R61.2  [also labelled IL34.TB.G13.D4_N]
DA/C.DA/B.B0: R62.1  [also labelled IL34.TB.G13.D0_N]
DA/C.DA/B.B1: R60.3  [also labelled IL34.TB.G13.D1_P]
DA/C.DA/B.B2: R61.8  [also labelled IL34.TB.G8.D3_P]
DDR_VDD: sheet SDRAMU/VDD, sheet SDRAML/VDD, port IO_POWER.VIOB
DDR_VTT: R60.9 R60.10 R60.11 R60.12 R60.13 R60.14 R60.15 R60.16 R61.9 R61.10 R61.11 R61.12 R61.13 R61.14 R61.15 R61.16 R62.9 R62.10 R62.11 R62.12 R62.13 R62.14 R62.15 R62.16 R65.2 ; sheet SDRAMU/VTT_REF, sheet SDRAML/VTT_REF, port IO_POWER.VTTB
IL34.LR.VTT: C136.1 C137.1 C138.2 C139.2 C140.2 C141.2 ; port IO_POWER.VTTA  [also labelled VTT]
IL34.VIOLR: port IO_POWER.VIOA  [also labelled IL34.VIOTB, VIO]
NetC135_2: C135.2 R63.1 R64.1

### Channels
MAIN/ARRAY/SDRAM33: designators end in A
MAIN/ARRAY/SDRAM32: designators end in B
MAIN/ARRAY/SDRAM31: designators end in C
MAIN/ARRAY/SDRAM30: designators end in D

### Buses and harness runs
harness DA/C = sheet SDRAML/DA/C = sheet SDRAMU/DA/C
harness G0 = sheet SDRAMU/G0
harness G1 = sheet SDRAMU/G1
harness G2 = sheet SDRAML/G0
harness G3 = sheet SDRAML/G1
harness IL34 = port IL34

### Layout directives
differential pair; net class ddr_ac; net class z50; net class tight: DA/C.CTRL.CLK_N_SDRAM33, DA/C.CTRL.CLK_P_SDRAM33
differential pair; net class z50; net class tight; net class ddr_g0: G3.S_N_SDRAM33, G3.S_P_SDRAM33
net class z50; net class ddr_g0: G3.D0_N_SDRAM33, G3.D0_P_SDRAM33, G3.D1_N_SDRAM33, G3.D1_P_SDRAM33, G3.D2_N_SDRAM33, G3.D2_P_SDRAM33, G3.D3_N_SDRAM33, G3.D3_P_SDRAM33, G3.D4_P_SDRAM33
differential pair; net class z50; net class tight; net class ddr_g1: G0.S_N_SDRAM33, G0.S_P_SDRAM33
differential pair; net class z50; net class tight; net class ddr_g2: G1.S_N_SDRAM33, G1.S_P_SDRAM33
differential pair; net class z50; net class tight; net class ddr_g3: G2.S_N_SDRAM33, G2.S_P_SDRAM33
net class z50; net class ddr_g1: G0.D0_N_SDRAM33, G0.D0_P_SDRAM33, G0.D1_N_SDRAM33, G0.D1_P_SDRAM33, G0.D2_N_SDRAM33, G0.D2_P_SDRAM33, G0.D3_N_SDRAM33, G0.D3_P_SDRAM33, G0.D4_P_SDRAM33
net class z50; net class ddr_g2: G1.D0_N_SDRAM33, G1.D0_P_SDRAM33, G1.D1_N_SDRAM33, G1.D1_P_SDRAM33, G1.D2_N_SDRAM33, G1.D2_P_SDRAM33, G1.D3_N_SDRAM33, G1.D3_P_SDRAM33, G1.D4_P_SDRAM33
net class z50; net class ddr_g3: G2.D0_N_SDRAM33, G2.D0_P_SDRAM33, G2.D1_N_SDRAM33, G2.D1_P_SDRAM33, G2.D2_N_SDRAM33, G2.D2_P_SDRAM33, G2.D3_N_SDRAM33, G2.D3_P_SDRAM33, G2.D4_P_SDRAM33
net class z50; net class ddr_ac: DA/C.CTRL.CASN_SDRAM33, DA/C.CTRL.CKE_SDRAM33, DA/C.CTRL.CSN_SDRAM33, DA/C.CTRL.ODT_SDRAM33, DA/C.CTRL.RASN_SDRAM33, DA/C.CTRL.RSTN_SDRAM33, DA/C.CTRL.WEN_SDRAM33, DA/C.DA/B.A0_SDRAM33, DA/C.DA/B.A1_SDRAM33, DA/C.DA/B.A2_SDRAM33, DA/C.DA/B.A3_SDRAM33, DA/C.DA/B.A4_SDRAM33, DA/C.DA/B.A5_SDRAM33, DA/C.DA/B.A6_SDRAM33, DA/C.DA/B.A7_SDRAM33, DA/C.DA/B.A8_SDRAM33, DA/C.DA/B.A9_SDRAM33, DA/C.DA/B.A10_SDRAM33, DA/C.DA/B.A11_SDRAM33, DA/C.DA/B.A12_SDRAM33, DA/C.DA/B.A13_SDRAM33, DA/C.DA/B.A14_SDRAM33, DA/C.DA/B.B0_SDRAM33, DA/C.DA/B.B1_SDRAM33, DA/C.DA/B.B2_SDRAM33

### Notes on the sheet
- Schematic Note: TB.G13.C_P/N actually goes to RIGHT bank (as opposed to BOTTOM bank)
- See EXCEPTION #3 on page 4 for more details.
- PCB Note: All signals are SSTL_135.
- PCB Note: DQS/DM/DQ signals have internal termination to Vtt.
- PCB Note: Net swapping done here for ease of routing.
- PCB Note: See FPGA datasheet for net swapping rules.
- Title
- Engineer
- Revision
- Drawn By
- Checked By
- Date
- Sheet
- of

### Library data of the parts
C135 = CAP: as C10 on sheet fpga-power; Voltage: 50V; Manufacturer P/N: GRM155R71H103KA88; Tolerance: ±10%; Footprint: *; Package: 0402
C136 C137 = CAP: as C4 on sheet fpga-power; Tolerance: ±20%; Manufacturer P/N: C2012X7S1A226M125; Voltage: 10V; Footprint: *; Package: 0805
C138-C141 = CAP: as C13 on sheet fpga-power; Tolerance: ±10%; Manufacturer P/N: GCM155R71H104KE02; Voltage: 50V; Footprint: *; Package: 0402
R60-R62 = EXB-2HV470JV: 8 Resistor Array 47 ±5% 0.0625W 25V 1506; Manufacturer: Panasonic; Tr: -55:125; Manufacturer P/N: EXB-2HV470JV; Package: 1506; Tolerance: ±5%
R63 R64 = RES: Thick Film Resistor 49.9 ±1% 0.1W 50V 0402; Manufacturer: Panasonic; Tcr: ±100; Tr: -55:155; Voltage: 50; Power: 0.1; Tolerance: ±1%; Manufacturer P/N: ERJ-2RKF49R9X; Alternatives: *; Footprint: *; Package: 0402
R65 = RES: Thick Film Resistor 1k ±1% 0.1W 50V 0402; Manufacturer: Panasonic; Tcr: ±100; Tr: -55:155; Voltage: 50; Power: 0.1; Tolerance: ±1%; Manufacturer P/N: ERJ-2RKF1001X; Alternatives: *; Footprint: *; Package: 0402